# Altium project Bran.PrjPCB
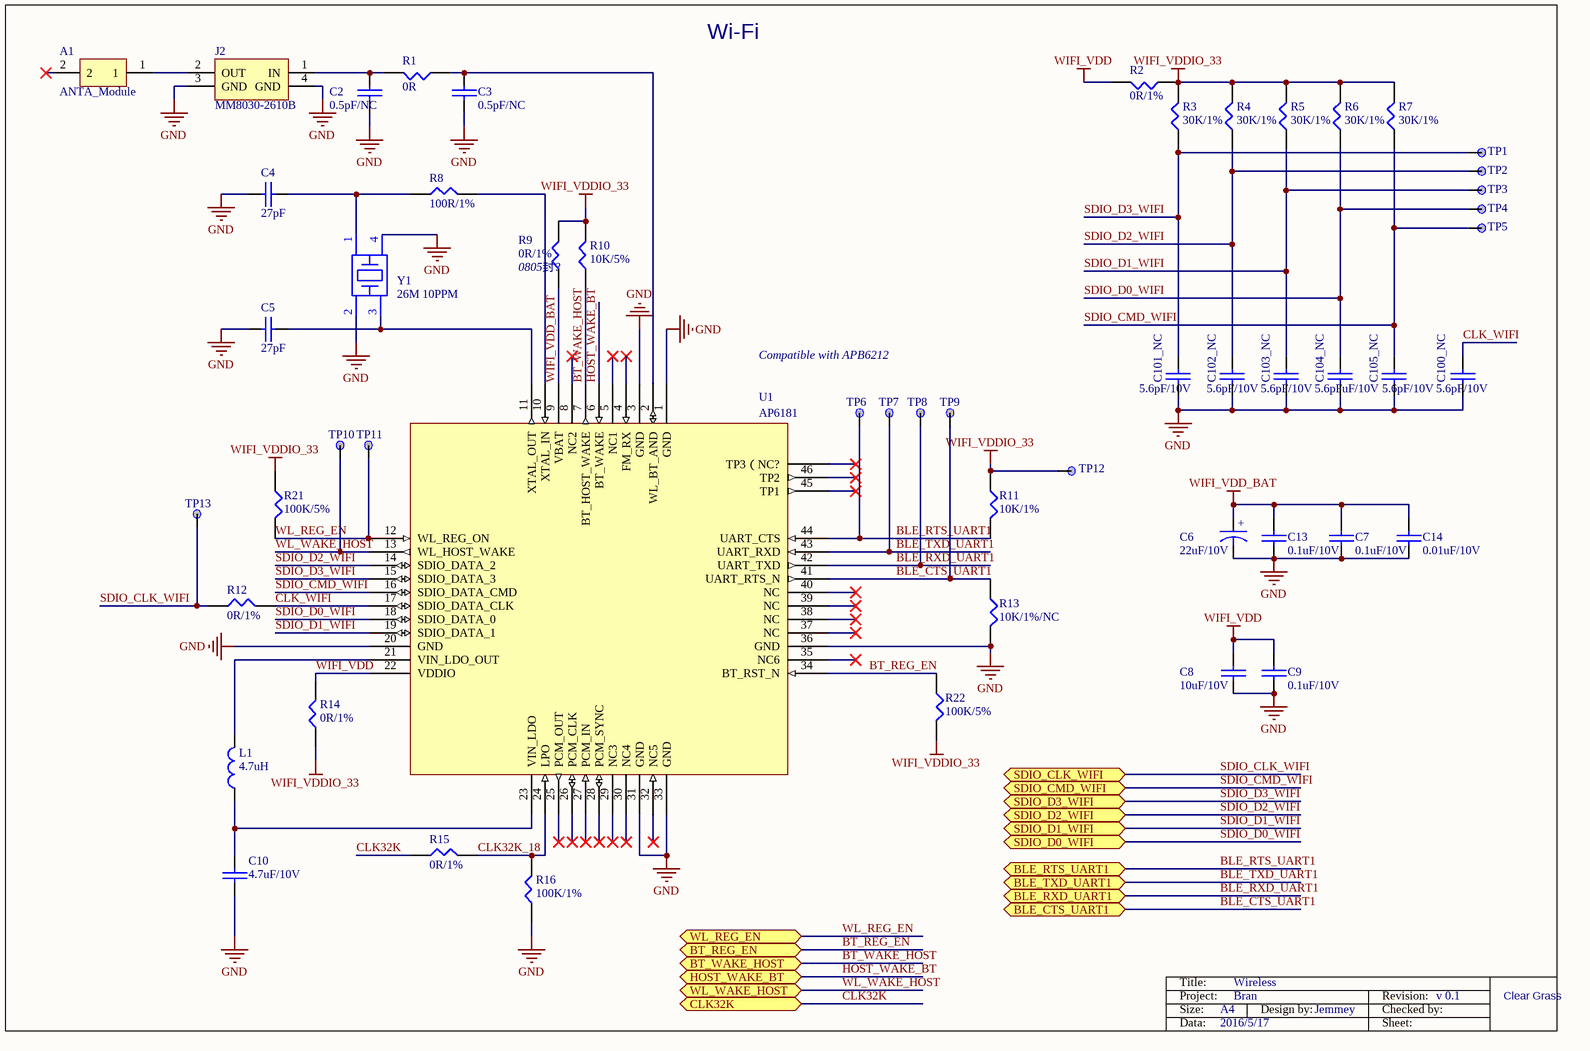
[diagram p0: Wireless.SchDoc]
8 sheets, 331 parts. Net scope: flat (ports and power ports of the same name join across sheets).
Sheets:
  Wireless.SchDoc
  NandFlash.SchDoc
  PMU.SchDoc
  Power.SchDoc
  Peripherals.SchDoc
  Auxiliary.SchDoc
  LCD_RGB.SchDoc
  M150.SchDoc

## Sheet Wireless.SchDoc: main_assy PCB
size A4

### Parts
A1  ANTA_Module  [IPEX]
C2  0.5pF/NC  [0402C]
C3  0.5pF/NC  [0402C]
C4  27pF  [0402C]
C5  27pF  [0402C]
C6  22uF/10V  [6032]
C7  0.1uF/10V  [0402C]
C8  10uF/10V  [0402C]
C9  0.1uF/10V  [0402C]
C10  4.7uF/10V  [0402C]
C13  0.1uF/10V  [0402C]
C14  0.01uF/10V  [0402C]
C100_NC  5.6pF/10V  [0402C]
C101_NC  5.6pF/10V  [0402C]
C102_NC  5.6pF/10V  [0402C]
C103_NC  5.6pF/10V  [0402C]
C104_NC  5.6pFuF/10V  [0402C]
C105_NC  5.6pF/10V  [0402C]
J2  MM8030-2610B  [IPEX]
L1  4.7uH  [Inductance]
R1  0R  [0402R]
R2  0R/1%  [0402R]
R3  30K/1%  [0402R]
R4  30K/1%  [0402R]
R5  30K/1%  [0402R]
R6  30K/1%  [0402R]
R7  30K/1%  [0402R]
R8  100R/1%  [0402R]
R9  0R/1%  [0402R]
R10  10K/5%  [0402R]
R11  10K/1%  [0402R]
R12  0R/1%  [0402R]
R13  10K/1%/NC  [0402R]
R14  0R/1%  [0402R]
R15  0R/1%  [0402R]
R16  100K/1%  [0402R]
R21  100K/5%  [0402R]
R22  100K/5%  [0402R]
TP1  TP  [TP_C40]  (value not drawn)
TP2  TP  [TP_C40]  (value not drawn)
TP3  TP  [TP_C40]  (value not drawn)
TP4  TP  [TP_C40]  (value not drawn)
TP5  TP  [TP_C40]  (value not drawn)
TP6  TP  [TP_C40]  (value not drawn)
TP7  TP  [TP_C40]  (value not drawn)
TP8  TP  [TP_C40]  (value not drawn)
TP9  TP  [TP_C40]  (value not drawn)
TP10  TP  [TP_C40]  (value not drawn)
TP11  TP  [TP_C40]  (value not drawn)
TP12  TP  [TP_C40]  (value not drawn)
TP13  TP  [TP_C40]  (value not drawn)
U1  AP6181
Y1  26M 10PPM  [XTALSMD2-2520]

### Ports
BLE_CTS_UART1 (bidir), BLE_RTS_UART1 (bidir), BLE_RXD_UART1 (bidir), BLE_TXD_UART1 (bidir), BT_REG_EN (bidir), BT_WAKE_HOST (bidir), CLK32K (bidir), HOST_WAKE_BT (bidir), SDIO_CLK_WIFI (bidir), SDIO_CMD_WIFI (bidir), SDIO_D0_WIFI (bidir), SDIO_D1_WIFI (bidir), SDIO_D2_WIFI (bidir), SDIO_D3_WIFI (bidir), WL_REG_EN (bidir), WL_WAKE_HOST (bidir)

### Nets
GND: C2.2 C3.2 C4.1 C5.1 C6.2 C7.1 C8.1 C9.1 C10.2 C13.1 C14.1 C100_NC.1 C101_NC.1 C102_NC.1 C103_NC.1 C104_NC.1 C105_NC.1 J2.3(GND) J2.4(GND) R13.2 R16.1 U1.1(GND) U1.3(GND) U1.20(GND) U1.31(GND) U1.33(GND) U1.36(GND) Y1.2 Y1.4
WIFI_VDD: C8.2 C9.2 R2.2 R14.2 U1.22(VDDIO)
WIFI_VDD_BAT: C6.1 C7.2 C13.2 C14.2 R9.1 U1.9(VBAT)
WIFI_VDDIO_33: R2.1 R3.2 R4.2 R5.2 R6.2 R7.2 R9.2 R10.2 R11.1 R14.1 R21.1 R22.2 TP12.1
BLE_CTS_UART1: R13.1 TP9.1 U1.41(UART_RTS_N) ; port BLE_CTS_UART1
BLE_RTS_UART1: R11.2 TP6.1 U1.44(UART_CTS) ; port BLE_RTS_UART1
BLE_RXD_UART1: TP8.1 U1.42(UART_TXD) ; port BLE_RXD_UART1
BLE_TXD_UART1: TP7.1 U1.43(UART_RXD) ; port BLE_TXD_UART1
BT_REG_EN: R22.1 U1.34(BT_RST_N) ; port BT_REG_EN
BT_WAKE_HOST: R10.1 U1.7(BT_HOST_WAKE) ; port BT_WAKE_HOST
CLK32K: R15.1 ; port CLK32K
CLK32K_18: R15.2 R16.2 U1.24(LPO)
CLK_WIFI: C100_NC.2 R12.2 U1.17(SDIO_DATA_CLK)
HOST_WAKE_BT: U1.6(BT_WAKE) ; port HOST_WAKE_BT
SDIO_CLK_WIFI: R12.1 TP13.1 ; port SDIO_CLK_WIFI
SDIO_CMD_WIFI: C105_NC.2 R7.1 TP5.1 U1.16(SDIO_DATA_CMD) ; port SDIO_CMD_WIFI
SDIO_D0_WIFI: C104_NC.2 R6.1 TP4.1 U1.18(SDIO_DATA_0) ; port SDIO_D0_WIFI
SDIO_D1_WIFI: C103_NC.2 R5.1 TP3.1 U1.19(SDIO_DATA_1) ; port SDIO_D1_WIFI
SDIO_D2_WIFI: C102_NC.2 R4.1 TP2.1 U1.14(SDIO_DATA_2) ; port SDIO_D2_WIFI
SDIO_D3_WIFI: C101_NC.2 R3.1 TP1.1 U1.15(SDIO_DATA_3) ; port SDIO_D3_WIFI
WL_REG_EN: R21.2 TP11.1 U1.12(WL_REG_ON) ; port WL_REG_EN
WL_WAKE_HOST: TP10.1 U1.13(WL_HOST_WAKE) ; port WL_WAKE_HOST
NetA1_1: A1.1 J2.2(OUT)
NetC2_1: C2.1 J2.1(IN) R1.2
NetC3_1: C3.1 R1.1 U1.2(WL_BT_AND)
NetC4_2: C4.2 R8.1 Y1.1
NetC5_2: C5.2 U1.11(XTAL_OUT) Y1.3
NetC10_1: C10.1 L1.1 U1.23(VIN_LDO)
NetL1_2: L1.2 U1.21(VIN_LDO_OUT)
NetR8_2: R8.2 U1.10(XTAL_IN)

Not connected (* = marked no-connect by the designer): A1 2*; U1 4(FM_RX)* 5(NC1)* 8(NC2)* 25(PCM_OUT)* 26(PCM_CLK)* 27(PCM_IN)* 28(PCM_SYNC)* 29(NC3)* 30(NC4)* 32(NC5)* 35(NC6)* 37(NC)* 38(NC)* 39(NC)* 40(NC)* 45(TP1)* 46(TP2)* ?1(TP3（NC?)*

### Notes on the sheet
- Wi-Fi
- (near R9) 0805封?
- Compatible with APB6212
- Title:
- Wireless
- Project:
- Size:
- Data:
- A4
- 2016/5/17
- Bran
- Design by:
- Jemmey
- Revision:
- Sheet:
- Checked by:
- v 0.1
- Clear Grass
- (in symbol Capacitor) +

### Library data of the parts
C2 = CAP: 厂家：Murata，型号：GRM1555C1H1R0BA01D
C3 = CAP: None
C4 C5 C7-C10 C13 C14 C100_NC C101_NC C102_NC C103_NC C104_NC C105_NC = CAP: 厂家：Murata，型号：GRM155R71A104KA01D
C6 = Capacitor
J2 = SMA: 厂家：Murata，型号：MM8030-2610B
L1 = CHOKE
R1 = RES1: 厂家：Yageo，型号：RC0402FR-070RL
R2-R16 R21 R22 = RES1: 厂家：Yageo，型号：RC0402FR-0710KL
TP1-TP13 = TP: Ordered by: Subcon
U1 = AP6181: 厂家：正基，型号：AP6181
Y1 = CRYSTAL2: 厂家：EPSON，型号：Q24FA20H0004400

## Sheet NandFlash.SchDoc: main_assy PCB
size A4
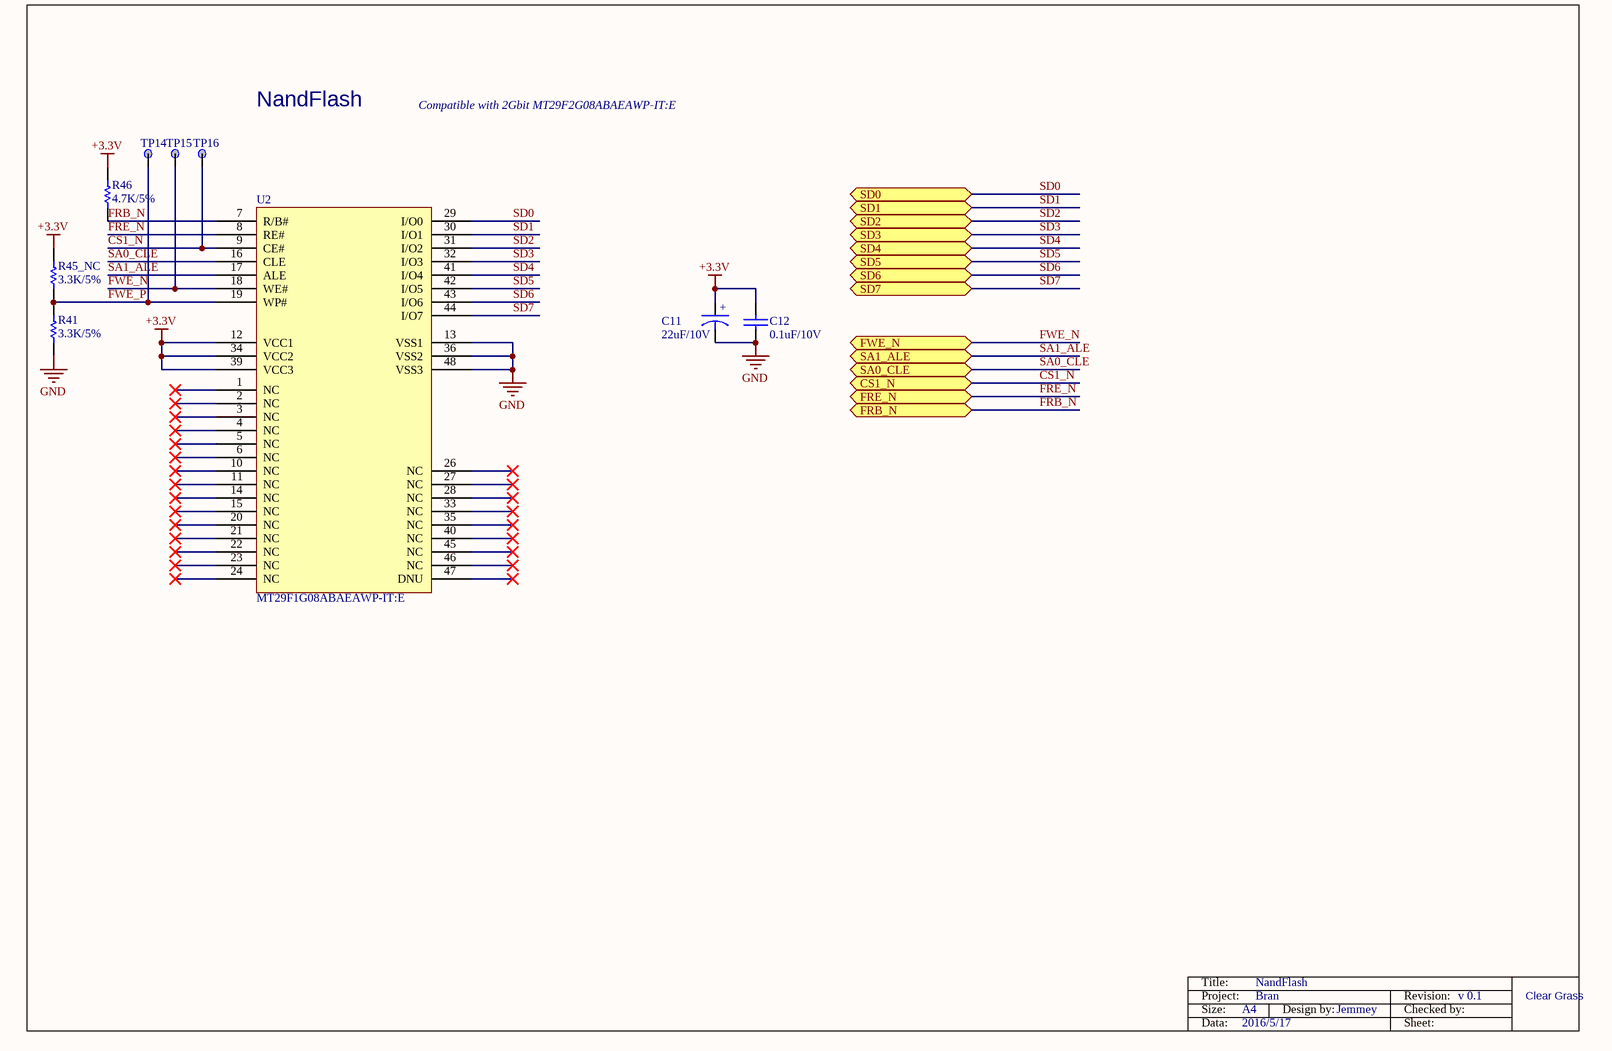
[diagram p1: NandFlash.SchDoc]

### Parts
C11  22uF/10V  [6032]
C12  0.1uF/10V  [0402C]
R41  3.3K/5%  [0603R]
R45_NC  3.3K/5%  [0603R]
R46  4.7K/5%  [0603R]
TP14  TP  [TP_C40]  (value not drawn)
TP15  TP  [TP_C40]  (value not drawn)
TP16  TP  [TP_C40]  (value not drawn)
U2  MT29F1G08ABAEAWP-IT:E

### Ports
CS1_N (bidir), FRB_N (bidir), FRE_N (bidir), FWE_N (bidir), SA0_CLE (bidir), SA1_ALE (bidir), SD0 (bidir), SD1 (bidir), SD2 (bidir), SD3 (bidir), SD4 (bidir), SD5 (bidir), SD6 (bidir), SD7 (bidir)

### Nets
+3.3V: C11.1 C12.2 R45_NC.1 R46.1 U2.12(VCC1) U2.34(VCC2) U2.39(VCC3)
GND: C11.2 C12.1 R41.2 U2.13(VSS1) U2.36(VSS2) U2.48(VSS3)
CS1_N: TP16.1 U2.9(CE#) ; port CS1_N
FRB_N: R46.2 U2.7(R/B#) ; port FRB_N
FRE_N: U2.8(RE#) ; port FRE_N
FWE_N: TP15.1 U2.18(WE#) ; port FWE_N
FWE_P: R41.1 R45_NC.2 TP14.1 U2.19(WP#)
SA0_CLE: U2.16(CLE) ; port SA0_CLE
SA1_ALE: U2.17(ALE) ; port SA1_ALE
SD0: U2.29(I/O0) ; port SD0
SD1: U2.30(I/O1) ; port SD1
SD2: U2.31(I/O2) ; port SD2
SD3: U2.32(I/O3) ; port SD3
SD4: U2.41(I/O4) ; port SD4
SD5: U2.42(I/O5) ; port SD5
SD6: U2.43(I/O6) ; port SD6
SD7: U2.44(I/O7) ; port SD7

Not connected (* = marked no-connect by the designer): U2 1(NC)* 2(NC)* 3(NC)* 4(NC)* 5(NC)* 6(NC)* 10(NC)* 11(NC)* 14(NC)* 15(NC)* 20(NC)* 21(NC)* 22(NC)* 23(NC)* 24(NC)* 26(NC)* 27(NC)* 28(NC)* 33(NC)* 35(NC)* 40(NC)* 45(NC)* 46(NC)* 47(DNU)*

### Notes on the sheet
- NandFlash
- Compatible with 2Gbit MT29F2G08ABAEAWP-IT:E
- Title:
- Project:
- Size:
- Data:
- A4
- 2016/5/17
- Bran
- Design by:
- Jemmey
- Revision:
- Sheet:
- Checked by:
- v 0.1
- Clear Grass
- (in symbol Capacitor) +

### Library data of the parts
C11 = Capacitor
C12 = CAP: 厂家：Murata，型号：GRM155R71A104KA01D
R41 R45_NC R46 = Res1: Resistor; Value: 1K; Ordered by: Subcon; Published: 8-Jun-2000; Revision: July-2002: Re-released for DXP Platform.; Publisher: Altium Limited
TP14-TP16 = TP: Ordered by: Subcon
U2 = NandFlash

## Sheet PMU.SchDoc: main_assy PCB
size A4
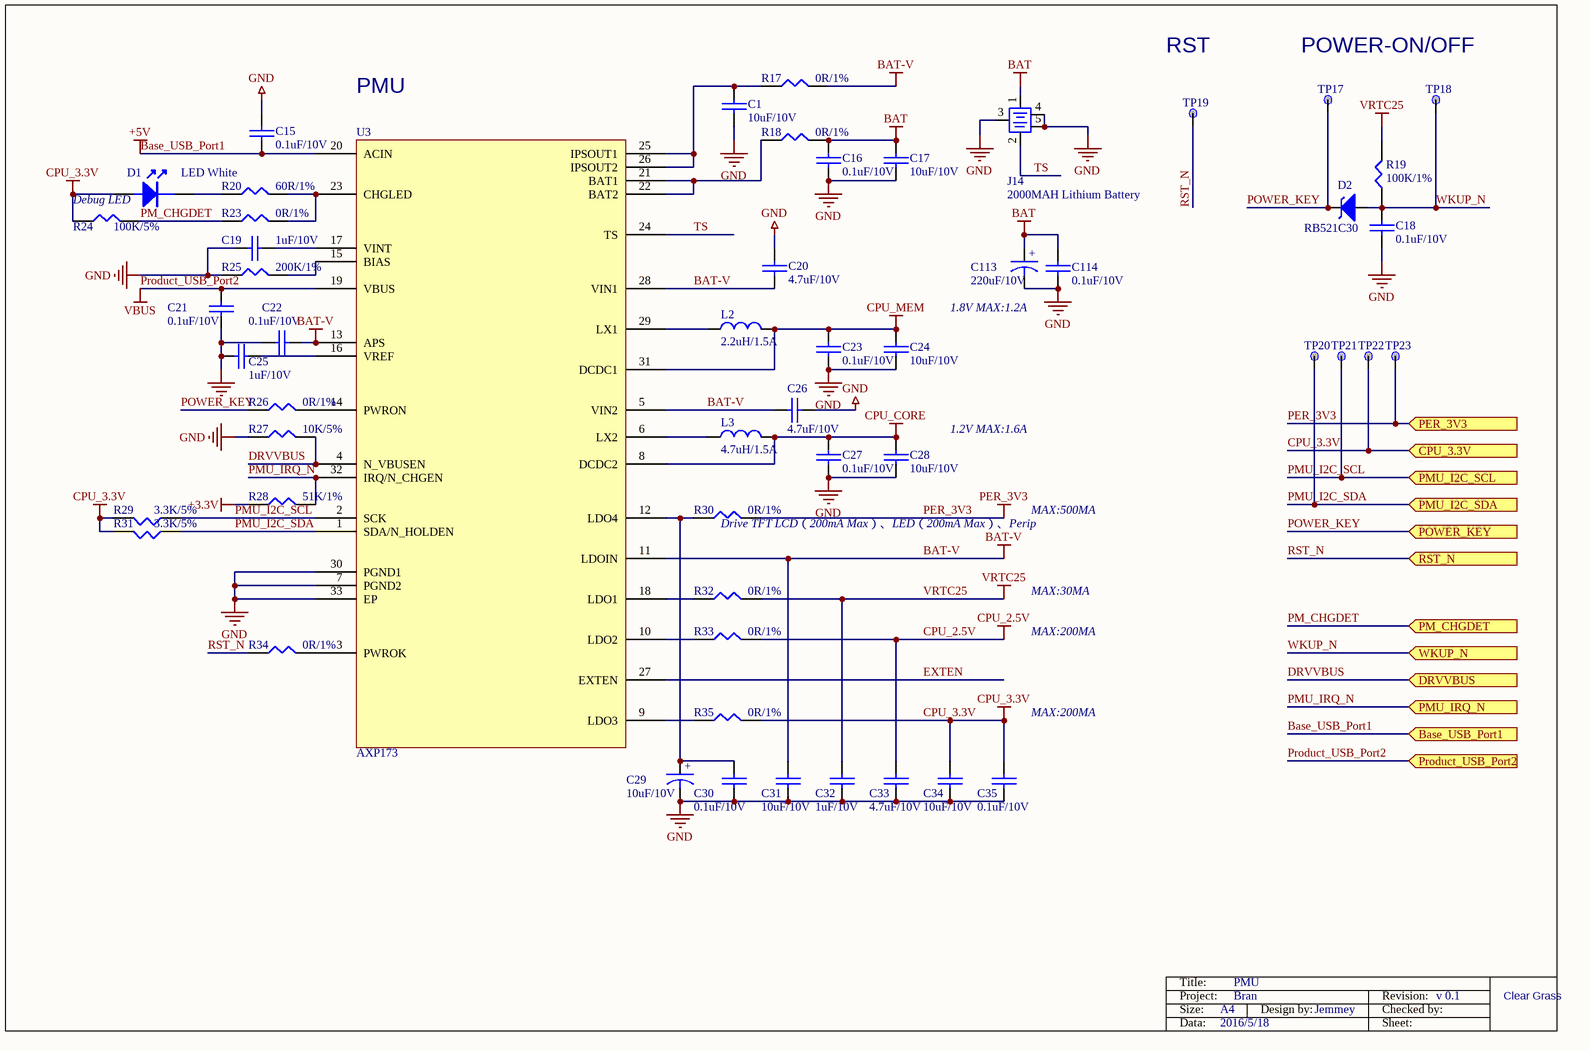
[diagram p2: PMU.SchDoc]

### Parts
C1  10uF/10V  [0402C]
C15  0.1uF/10V  [0402C]
C16  0.1uF/10V  [0402C]
C17  10uF/10V  [0402C]
C18  0.1uF/10V  [0402C]
C19  1uF/10V  [0402C]
C20  4.7uF/10V  [0402C]
C21  0.1uF/10V  [0402C]
C22  0.1uF/10V  [0402C]
C23  0.1uF/10V  [0402C]
C24  10uF/10V  [0402C]
C25  1uF/10V  [0402C]
C26  4.7uF/10V  [0402C]
C27  0.1uF/10V  [0402C]
C28  10uF/10V  [0402C]
C29  10uF/10V  [6032]
C30  0.1uF/10V  [0402C]
C31  10uF/10V  [0402C]
C32  1uF/10V  [0402C]
C33  4.7uF/10V  [0402C]
C34  10uF/10V  [0402C]
C35  0.1uF/10V  [0402C]
C113  220uF/10V  [6032]
C114  0.1uF/10V  [0402C]
D1  LED White  [0402LED]
D2  RB521C30  [DO-214AC]
J14  2000MAH Lithium Battery  [Molex-1-3A]
L2  2.2uH/1.5A  [Inductance]
L3  4.7uH/1.5A  [Inductance]
R17  0R/1%  [0402R]
R18  0R/1%  [0402R]
R19  100K/1%  [0402R]
R20  60R/1%  [0402R]
R23  0R/1%  [0402R]
R24  100K/5%  [0402R]
R25  200K/1%  [0402R]
R26  0R/1%  [0402R]
R27  10K/5%  [0402R]
R28  51K/1%  [0402R]
R29  3.3K/5%  [0402R]
R30  0R/1%  [0402R]
R31  3.3K/5%  [0402R]
R32  0R/1%  [0402R]
R33  0R/1%  [0402R]
R34  0R/1%  [0402R]
R35  0R/1%  [0402R]
TP17  TP  [TP_C40]  (value not drawn)
TP18  TP  [TP_C40]  (value not drawn)
TP19  TP  [TP_C40]  (value not drawn)
TP20  TP  [TP_C40]  (value not drawn)
TP21  TP  [TP_C40]  (value not drawn)
TP22  TP  [TP_C40]  (value not drawn)
TP23  TP  [TP_C40]  (value not drawn)
U3  AXP173

### Ports
Base_USB_Port1 (in), CPU_3.3V (in), DRVVBUS (in), PER_3V3 (in), PM_CHGDET (in), PMU_I2C_SCL (in), PMU_I2C_SDA (in), PMU_IRQ_N (in), POWER_KEY (in), Product_USB_Port2 (in), RST_N (in), WKUP_N (in)

### Nets
+3.3V: R28.1
Base_USB_Port1: C15.1 U3.20(ACIN) ; port Base_USB_Port1  [also labelled +5V]
BAT: C16.2 C17.2 C113.1 C114.2 J14.1(VCC) R18.2
BAT-V: C20.2 C22.1 C26.2 C31.1 R17.2 U3.5(VIN2) U3.11(LDOIN) U3.13(APS) U3.28(VIN1)
CPU_2.5V: C33.1 R33.2
CPU_3.3V: C34.1 C35.1 D1.2 R24.1 R29.2 R31.2 R35.2 TP22.1 ; port CPU_3.3V
CPU_CORE: C27.2 C28.2 L3.2 U3.8(DCDC2)
CPU_MEM: C23.2 C24.2 L2.2 U3.31(DCDC1)
GND: C1.1 C15.2 C16.1 C17.1 C18.1 C19.2 C20.1 C21.1 C22.2 C23.1 C24.1 C25.2 C26.1 C27.1 C28.1 C29.2 C30.1 C31.2 C32.2 C33.2 C34.2 C35.2 C113.2 C114.1 J14.3(GND) J14.4(PAD) J14.5(PAD) R25.1 R27.1 U3.7(PGND2) U3.30(PGND1) U3.33(EP)
PER_3V3: R30.2 TP23.1 ; port PER_3V3
Product_USB_Port2: C21.2 U3.19(VBUS) ; port Product_USB_Port2  [also labelled VBUS]
VRTC25: C32.1 R19.2 R32.2
DRVVBUS: R27.2 U3.4(N_VBUSEN) ; port DRVVBUS
EXTEN: U3.27(EXTEN)
PM_CHGDET: R23.1 R24.2 ; port PM_CHGDET
PMU_I2C_SCL: R29.1 TP21.1 U3.2(SCK) ; port PMU_I2C_SCL
PMU_I2C_SDA: R31.1 TP20.1 U3.1(SDA/N_HOLDEN) ; port PMU_I2C_SDA
PMU_IRQ_N: R28.2 U3.32(IRQ/N_CHGEN) ; port PMU_IRQ_N
POWER_KEY: D2.1(K) R26.1 TP17.1 ; port POWER_KEY
RST_N: R34.1 TP19.1 ; port RST_N
TS: J14.2(NTC) U3.24(TS)
WKUP_N: C18.2 D2.2(A) R19.1 TP18.1 ; port WKUP_N
NetC1_2: C1.2 R17.1 U3.25(IPSOUT1) U3.26(IPSOUT2)
NetC19_1: C19.1 U3.17(VINT)
NetC25_1: C25.1 U3.16(VREF)
NetC29_1: C29.1 C30.2 R30.1 U3.12(LDO4)
NetD1_1: D1.1 R20.1
NetL2_1: L2.1 U3.29(LX1)
NetL3_1: L3.1 U3.6(LX2)
NetR18_1: R18.1 U3.21(BAT1) U3.22(BAT2)
NetR20_2: R20.2 R23.2 U3.23(CHGLED)
NetR25_2: R25.2 U3.15(BIAS)
NetR26_2: R26.2 U3.14(PWRON)
NetR32_1: R32.1 U3.18(LDO1)
NetR33_1: R33.1 U3.10(LDO2)
NetR34_2: R34.2 U3.3(PWROK)
NetR35_1: R35.1 U3.9(LDO3)

### Notes on the sheet
- PMU
- RST
- POWER-ON/OFF
- (near D1) Debug LED
- 1.8V MAX:1.2A
- 1.2V MAX:1.6A
- MAX:500MA
- (near R30) Drive TFT LCD（200mA Max）、LED（200mA Max）、Perip
- MAX:30MA
- MAX:200MA
- Title:
- Project:
- Size:
- Data:
- A4
- 2016/5/18
- Bran
- Design by:
- Jemmey
- Revision:
- Sheet:
- Checked by:
- v 0.1
- Clear Grass
- (in symbol Capacitor) +

### Library data of the parts
C1 C15-C28 C30-C35 C114 = CAP: 厂家：Murata，型号：GRM155R71A104KA01D
C29 C113 = Capacitor
D1 = LED: 厂家：ROHM，型号：SCMP13WBC8W1**
D2 = Sc: 厂家：ROHM，型号：RB480Y-90
J14 = BL-5C
L2 L3 = CHOKE
R17-R20 R23-R35 = RES1: 厂家：Yageo，型号：RC0402FR-0710KL
TP17-TP23 = TP: Ordered by: Subcon

## Sheet Power.SchDoc: main_assy PCB
size A4
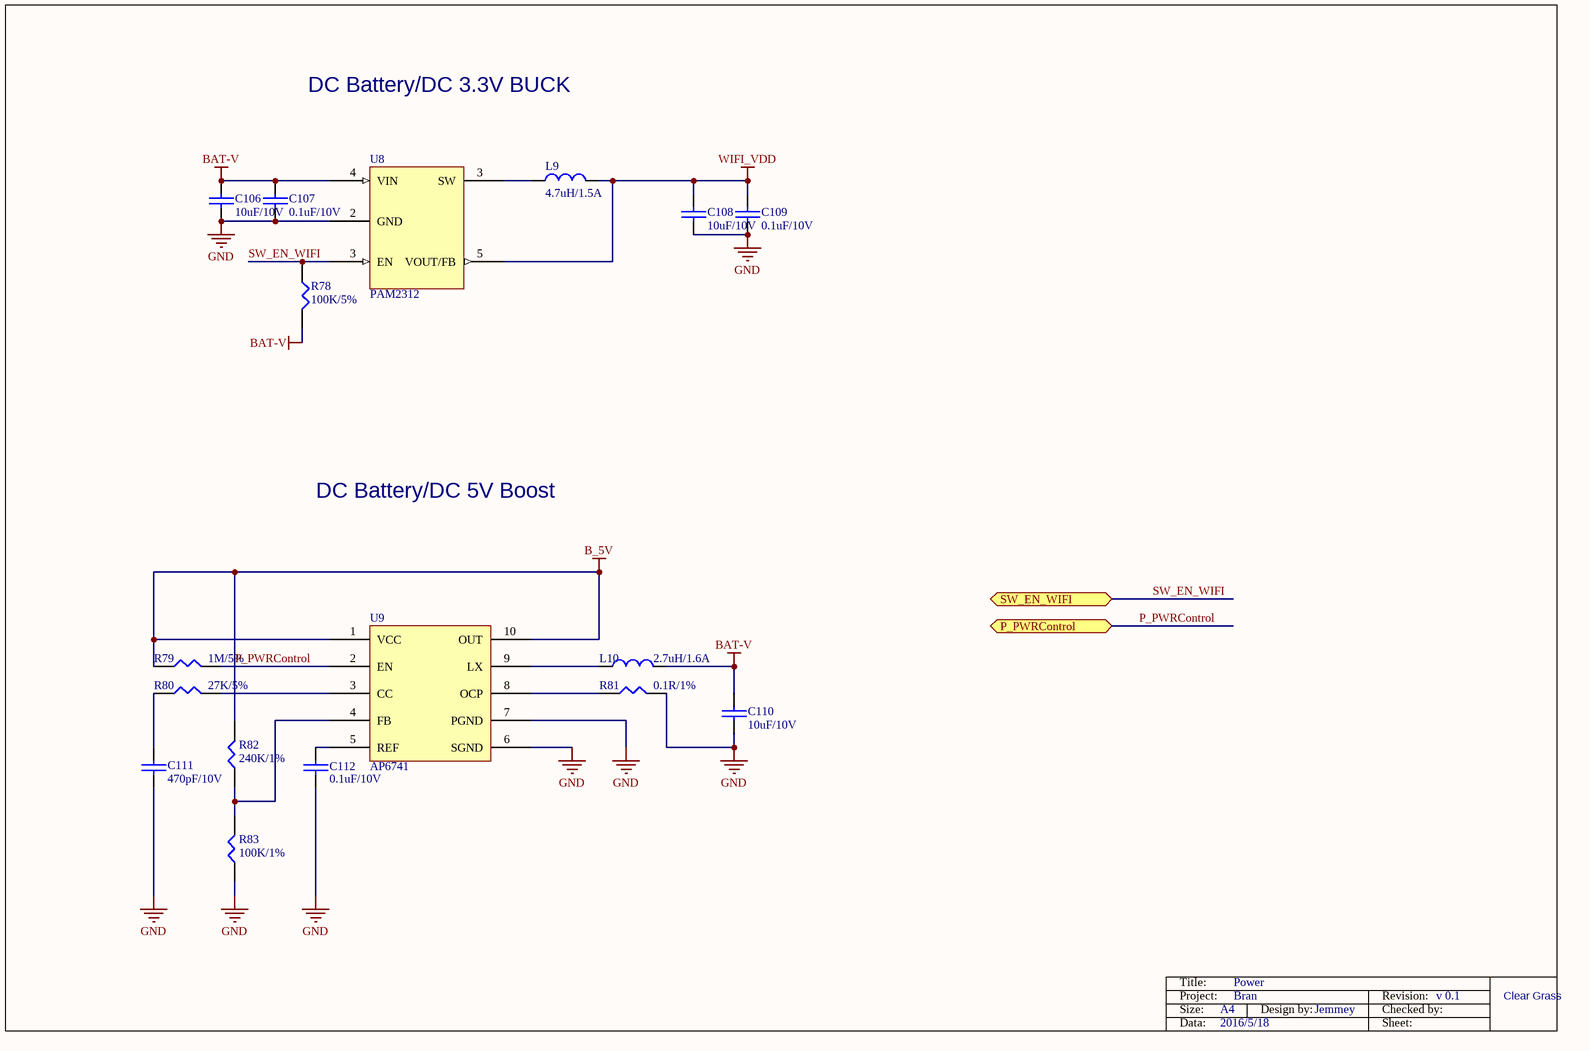
[diagram p3: Power.SchDoc]

### Parts
C106  10uF/10V  [0402C]
C107  0.1uF/10V  [0402C]
C108  10uF/10V  [0402C]
C109  0.1uF/10V  [0402C]
C110  10uF/10V  [0402C]
C111  470pF/10V  [0402C]
C112  0.1uF/10V  [0402C]
L9  4.7uH/1.5A  [Inductance]
L10  2.7uH/1.6A  [Inductance]
R78  100K/5%  [0402R]
R79  1M/5%  [0402R]
R80  27K/5%  [0402R]
R81  0.1R/1%  [1206]
R82  240K/1%  [0402R]
R83  100K/1%  [0402R]
U8  PAM2312  [MOLEX_47590001]
U9  AP6741  [MOLEX_47590001]

### Ports
P_PWRControl (bidir), SW_EN_WIFI (bidir)

### Nets
BAT-V: C106.2 C107.2 C110.2 L10.2 R78.2 U8.4(VIN)
GND: C106.1 C107.1 C108.1 C109.1 C110.1 C111.1 C112.1 R81.2 R83.1 U8.2(GND) U9.6(SGND) U9.7(PGND)
P_PWRControl: R79.1 R79.2 R82.2 U9.1(VCC) U9.2(EN) U9.10(OUT) ; port P_PWRControl  [also labelled B_5V]
WIFI_VDD: C108.2 C109.2 L9.2 U8.5(VOUT/FB)
SW_EN_WIFI: R78.1 U8.3(EN) ; port SW_EN_WIFI
NetC111_2: C111.2 R80.1
NetC112_2: C112.2 U9.5(REF)
NetL9_1: L9.1 U8.3(SW)
NetL10_1: L10.1 U9.9(LX)
NetR80_2: R80.2 U9.3(CC)
NetR81_1: R81.1 U9.8(OCP)
NetR82_1: R82.1 R83.2 U9.4(FB)

### Notes on the sheet
- DC Battery/DC 3.3V BUCK
- DC Battery/DC 5V Boost
- Title:
- Power
- Project:
- Size:
- Data:
- A4
- 2016/5/18
- Bran
- Design by:
- Jemmey
- Revision:
- Sheet:
- Checked by:
- v 0.1
- Clear Grass

### Library data of the parts
C106-C112 = CAP: 厂家：Murata，型号：GRM155R71A104KA01D
L9 L10 = CHOKE
R78-R83 = RES1: 厂家：Yageo，型号：RC0402FR-0710KL
U8 = P: 厂家：Diodes，型号：PAM2312TSOT255330; Manuf_1: MOLEX; Manuf_Part_1: 475900001; Ordered by: Subcon; Silkscreen: USB USER
U9 = PAM: 厂家：Diodes，型号：PAM2401YPADJ; Manuf_1: MOLEX; Manuf_Part_1: 475900001; Ordered by: Subcon; Silkscreen: USB USER

## Sheet Peripherals.SchDoc: main_assy PCB
size A4
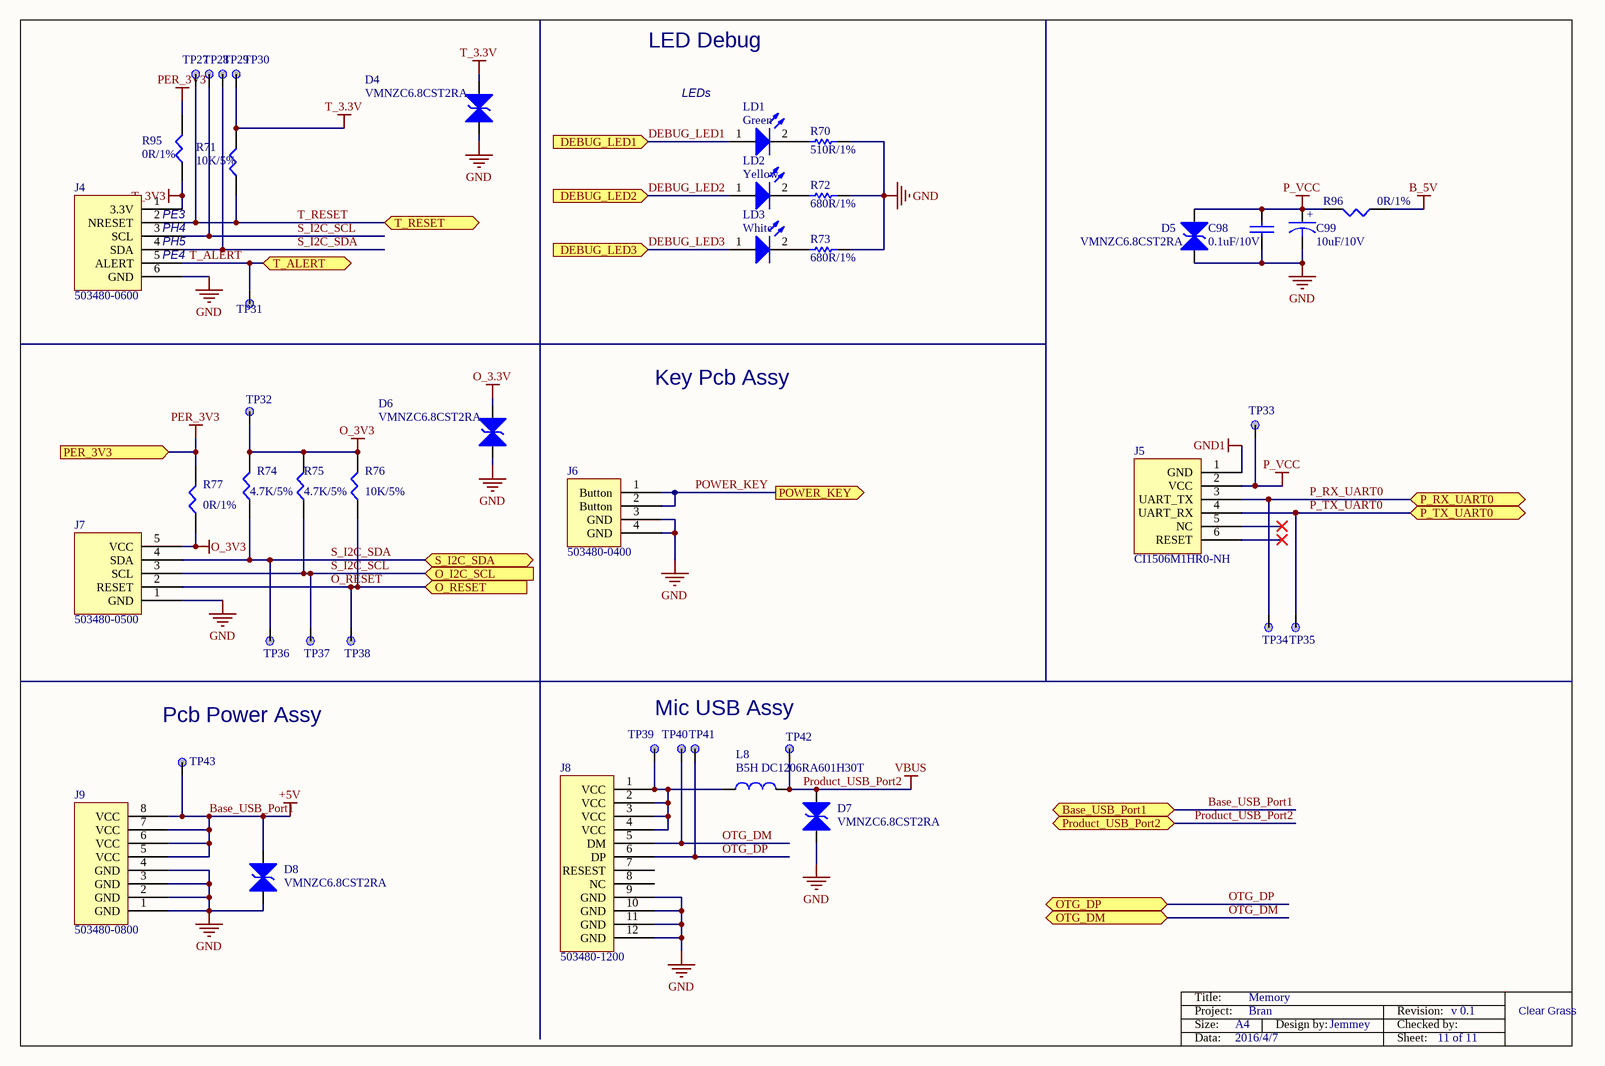
[diagram p4: Peripherals.SchDoc]

### Parts
(Parts that share a designator on the sheet are numbered #1, #2 ... from top to bottom, then left to right.)
C98  0.1uF/10V  [0402C]
C99  10uF/10V  [6032]
D4  VMNZC6.8CST2RA  [0402]
D5  VMNZC6.8CST2RA  [0402]
D6  VMNZC6.8CST2RA  [0402]
D7  VMNZC6.8CST2RA  [0402]
D8  VMNZC6.8CST2RA  [0402]
J4  503480-0600
J5  CI1506M1HR0-NH
J6#1  503480-0400
J7  503480-0500
J8  503480-1200
J9  503480-0800
L8  B5H DC1206RA601H30T  [1206]
LD1  Green  [0603D]
LD2  Yellow  [0603D]
LD3  White  [0603D]
R70  510R/1%  [0402R]
R71  10K/5%  [0402R]
R72  680R/1%  [0402R]
R73  680R/1%  [0402R]
R74  4.7K/5%  [0402R]
R75  4.7K/5%  [0402R]
R76  10K/5%  [0402R]
R77  0R/1%  [0402R]
R95  0R/1%  [0603R]
R96  0R/1%  [0603R]
TP27  TP  [TP_C40]  (value not drawn)
TP28  TP  [TP_C40]  (value not drawn)
TP29  TP  [TP_C40]  (value not drawn)
TP30  TP  [TP_C40]  (value not drawn)
TP31  TP  [TP_C40]  (value not drawn)
TP32  TP  [TP_C40]  (value not drawn)
TP33  TP  [TP_C40]  (value not drawn)
TP34  TP  [TP_C40]  (value not drawn)
TP35  TP  [TP_C40]  (value not drawn)
TP36  TP  [TP_C40]  (value not drawn)
TP37  TP  [TP_C40]  (value not drawn)
TP38  TP  [TP_C40]  (value not drawn)
TP39  TP  [TP_C40]  (value not drawn)
TP40  TP  [TP_C40]  (value not drawn)
TP41  TP  [TP_C40]  (value not drawn)
TP42  TP  [TP_C40]  (value not drawn)
TP43  TP  [TP_C40]  (value not drawn)

### Ports
Base_USB_Port1 (bidir), DEBUG_LED1 (in), DEBUG_LED2 (in), DEBUG_LED3 (in), O_I2C_SCL (in), O_RESET (in), OTG_DM (bidir), OTG_DP (bidir), P_RX_UART0 (bidir), P_TX_UART0 (bidir), PER_3V3 (in), POWER_KEY (out), Product_USB_Port2 (bidir), S_I2C_SDA (bidir), T_ALERT (bidir), T_RESET (bidir)

### Nets
B_5V: R96.1  [project net P_PWRControl]
Base_USB_Port1: D8.2(dIode2) J9.5(VCC) J9.6(VCC) J9.7(VCC) J9.8(VCC) TP43.1 ; port Base_USB_Port1  [also labelled +5V]
GND: C98.1 C99.2 D4.1(Diode1) D5.1(Diode1) D6.1(Diode1) D7.1(Diode1) D8.1(Diode1) J4.6(GND) J6#1.3(GND) J6#1.4(GND) J7.1(GND) J8.9(GND) J8.10(GND) J8.11(GND) J8.12(GND) J9.1(GND) J9.2(GND) J9.3(GND) J9.4(GND) R70.1 R72.1 R73.1
GND1: J5.1(GND)
O_3.3V: D6.2(dIode2)
O_3V3: J7.5(VCC) R74.2 R75.2 R76.2 R77.1 TP32.1
P_VCC: C98.2 C99.1 D5.2(dIode2) J5.2(VCC) R96.2 TP33.1
PER_3V3: R77.2 R95.2 ; port PER_3V3
Product_USB_Port2: D7.2(dIode2) L8.2 TP42.1 ; port Product_USB_Port2  [also labelled VBUS]
T_3.3V: D4.2(dIode2) R71.2 TP30.1
T_3V3: J4.1(3.3V) R95.1
DEBUG_LED1: LD1.1(A) ; port DEBUG_LED1
DEBUG_LED2: LD2.1(A) ; port DEBUG_LED2
DEBUG_LED3: LD3.1(A) ; port DEBUG_LED3
O_RESET: J7.2(RESET) R76.1 TP38.1 ; port O_RESET
OTG_DM: J8.5(DM) TP40.1 ; port OTG_DM
OTG_DP: J8.6(DP) TP41.1 ; port OTG_DP
P_RX_UART0: J5.3(UART_TX) TP34.1 ; port P_RX_UART0
P_TX_UART0: J5.4(UART_RX) TP35.1 ; port P_TX_UART0
POWER_KEY: J6#1.1(Button) J6#1.2(Button) ; port POWER_KEY
S_I2C_SCL: J4.3(SCL) J7.3(SCL) R75.1 TP28.1 TP37.1 ; port O_I2C_SCL
S_I2C_SDA: J4.4(SDA) J7.4(SDA) R74.1 TP29.1 TP36.1 ; port S_I2C_SDA
T_ALERT: J4.5(ALERT) TP31.1 ; port T_ALERT
T_RESET: J4.2(NRESET) R71.1 TP27.1 ; port T_RESET
NetJ8_1: J8.1(VCC) J8.2(VCC) J8.3(VCC) J8.4(VCC) L8.1 TP39.1
NetLD1_2: LD1.2(K) R70.2
NetLD2_2: LD2.2(K) R72.2
NetLD3_2: LD3.2(K) R73.2

Not connected (* = marked no-connect by the designer): J5 5(NC)* 6(RESET)*; J8 7(RESEST) 8(NC)

### Notes on the sheet
- LED Debug
- LEDs
- (near J4) PE4
- (near J4) PE3
- (near J4) PH4
- (near J4) PH5
- Key Pcb Assy
- (near TP43) Pcb Power Assy
- Mic USB Assy
- Title:
- Memory
- Project:
- Size:
- Data:
- A4
- 2016/4/7
- Bran
- Design by:
- Jemmey
- Revision:
- Sheet:
- Checked by:
- 11 of 11
- v 0.1
- Clear Grass
- (in symbol Capacitor) +

### Library data of the parts
C98 = CAP: 厂家：Murata，型号：GRM155R71A104KA01D
C99 = Capacitor
D4-D8 = ESD_1: 厂家：ROHM，型号：VMNZC6.8CST2RA
J4 = 50348: 厂家：Molex，型号：503480-0600
J5 = CI1506M1HR0-NH: 厂家：瀚荃股份，型号：CI1506M1HR0-NH
J6#1 = 50348: 厂家：Molex，型号：503480-0400
J7 = 50348: 厂家：Molex，型号：503480-0500
J8 = 50348: 厂家：Molex，型号：503480-1200
J9 = 50348: 厂家：Molex，型号：503480-0800
L8 = CHOKE: 厂家：宇磁，型号：B5H DC1206RA601H30T
LD1-LD3 = LED2: Typical RED, GREEN, YELLOW, AMBER GaAs LED; Ordered by: Subcon; ECCN_US/EU: EAR99/NEC; Published: 8-Jun-2000; Revision: July-2002: Re-released for DXP Platform.; Publisher: Altium Limited
R70 R72 R73 = Res1: Resistor; Value: 1K; Ordered by: Subcon; Published: 8-Jun-2000; Revision: July-2002: Re-released for DXP Platform.; Publisher: Altium Limited
R71 R74 R75 R77 = RES1: 厂家：Yageo，型号：
R76 = RES1: 厂家：Yageo，型号：RC0402FR-0710KL
R95 R96 = RES1: 厂家：Yageo，型号：RC0402FR-070RL
TP27-TP43 = TP: Ordered by: Subcon

## Sheet Auxiliary.SchDoc: main_assy PCB
size A4
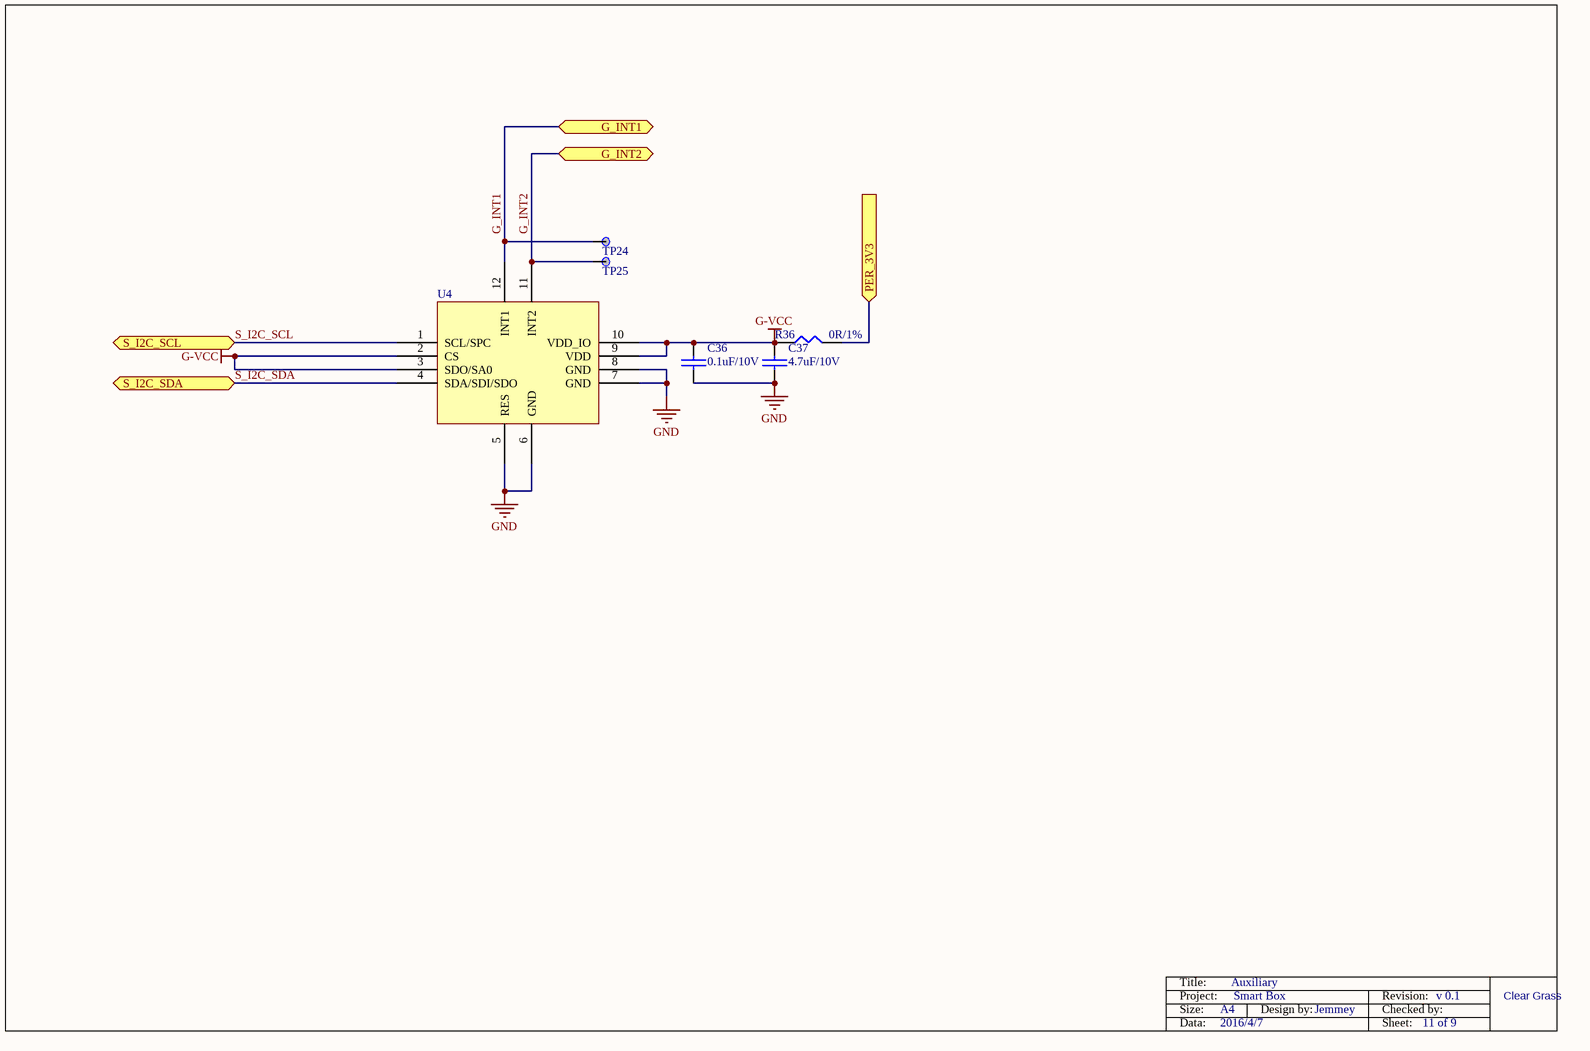
[diagram p5: Auxiliary.SchDoc]

### Parts
C36  0.1uF/10V  [0402C]
C37  4.7uF/10V  [0603C]
R36  0R/1%  [0402R]
TP24  TP  [TP_C40]  (value not drawn)
TP25  TP  [TP_C40]  (value not drawn)
U4  (no value)

### Ports
G_INT1 (bidir), G_INT2 (bidir), PER_3V3 (in), S_I2C_SCL (bidir), S_I2C_SDA (bidir)

### Nets
G-VCC: C36.1 C37.1 R36.1 U4.2(CS) U4.3(SDO/SA0) U4.9(VDD) U4.10(VDD_IO)
GND: C36.2 C37.2 U4.5(RES) U4.6(GND) U4.7(GND) U4.8(GND)
PER_3V3: R36.2 ; port PER_3V3
G_INT1: TP24.1 U4.12(INT1) ; port G_INT1
G_INT2: TP25.1 U4.11(INT2) ; port G_INT2
S_I2C_SCL: U4.1(SCL/SPC) ; port S_I2C_SCL
S_I2C_SDA: U4.4(SDA/SDI/SDO) ; port S_I2C_SDA

### Notes on the sheet
- Title:
- Auxiliary
- Project:
- Size:
- Data:
- A4
- 2016/4/7
- Smart Box
- Design by:
- Jemmey
- Revision:
- Sheet:
- Checked by:
- 11 of 9
- v 0.1
- Clear Grass

### Library data of the parts
C36 = CAP: 厂家：Murata，型号：GRM155R71A104KA01D
C37 = CAP: 厂家：Murata，型号：GRM188R61A106KE69D
R36 = RES1: 厂家：Yageo，型号：RC0402FR-0710KL
TP24 TP25 = TP: Ordered by: Subcon
U4 = LIS2DE12: 厂家：ST，型号：LIS2DH12

## Sheet LCD_RGB.SchDoc
size A3
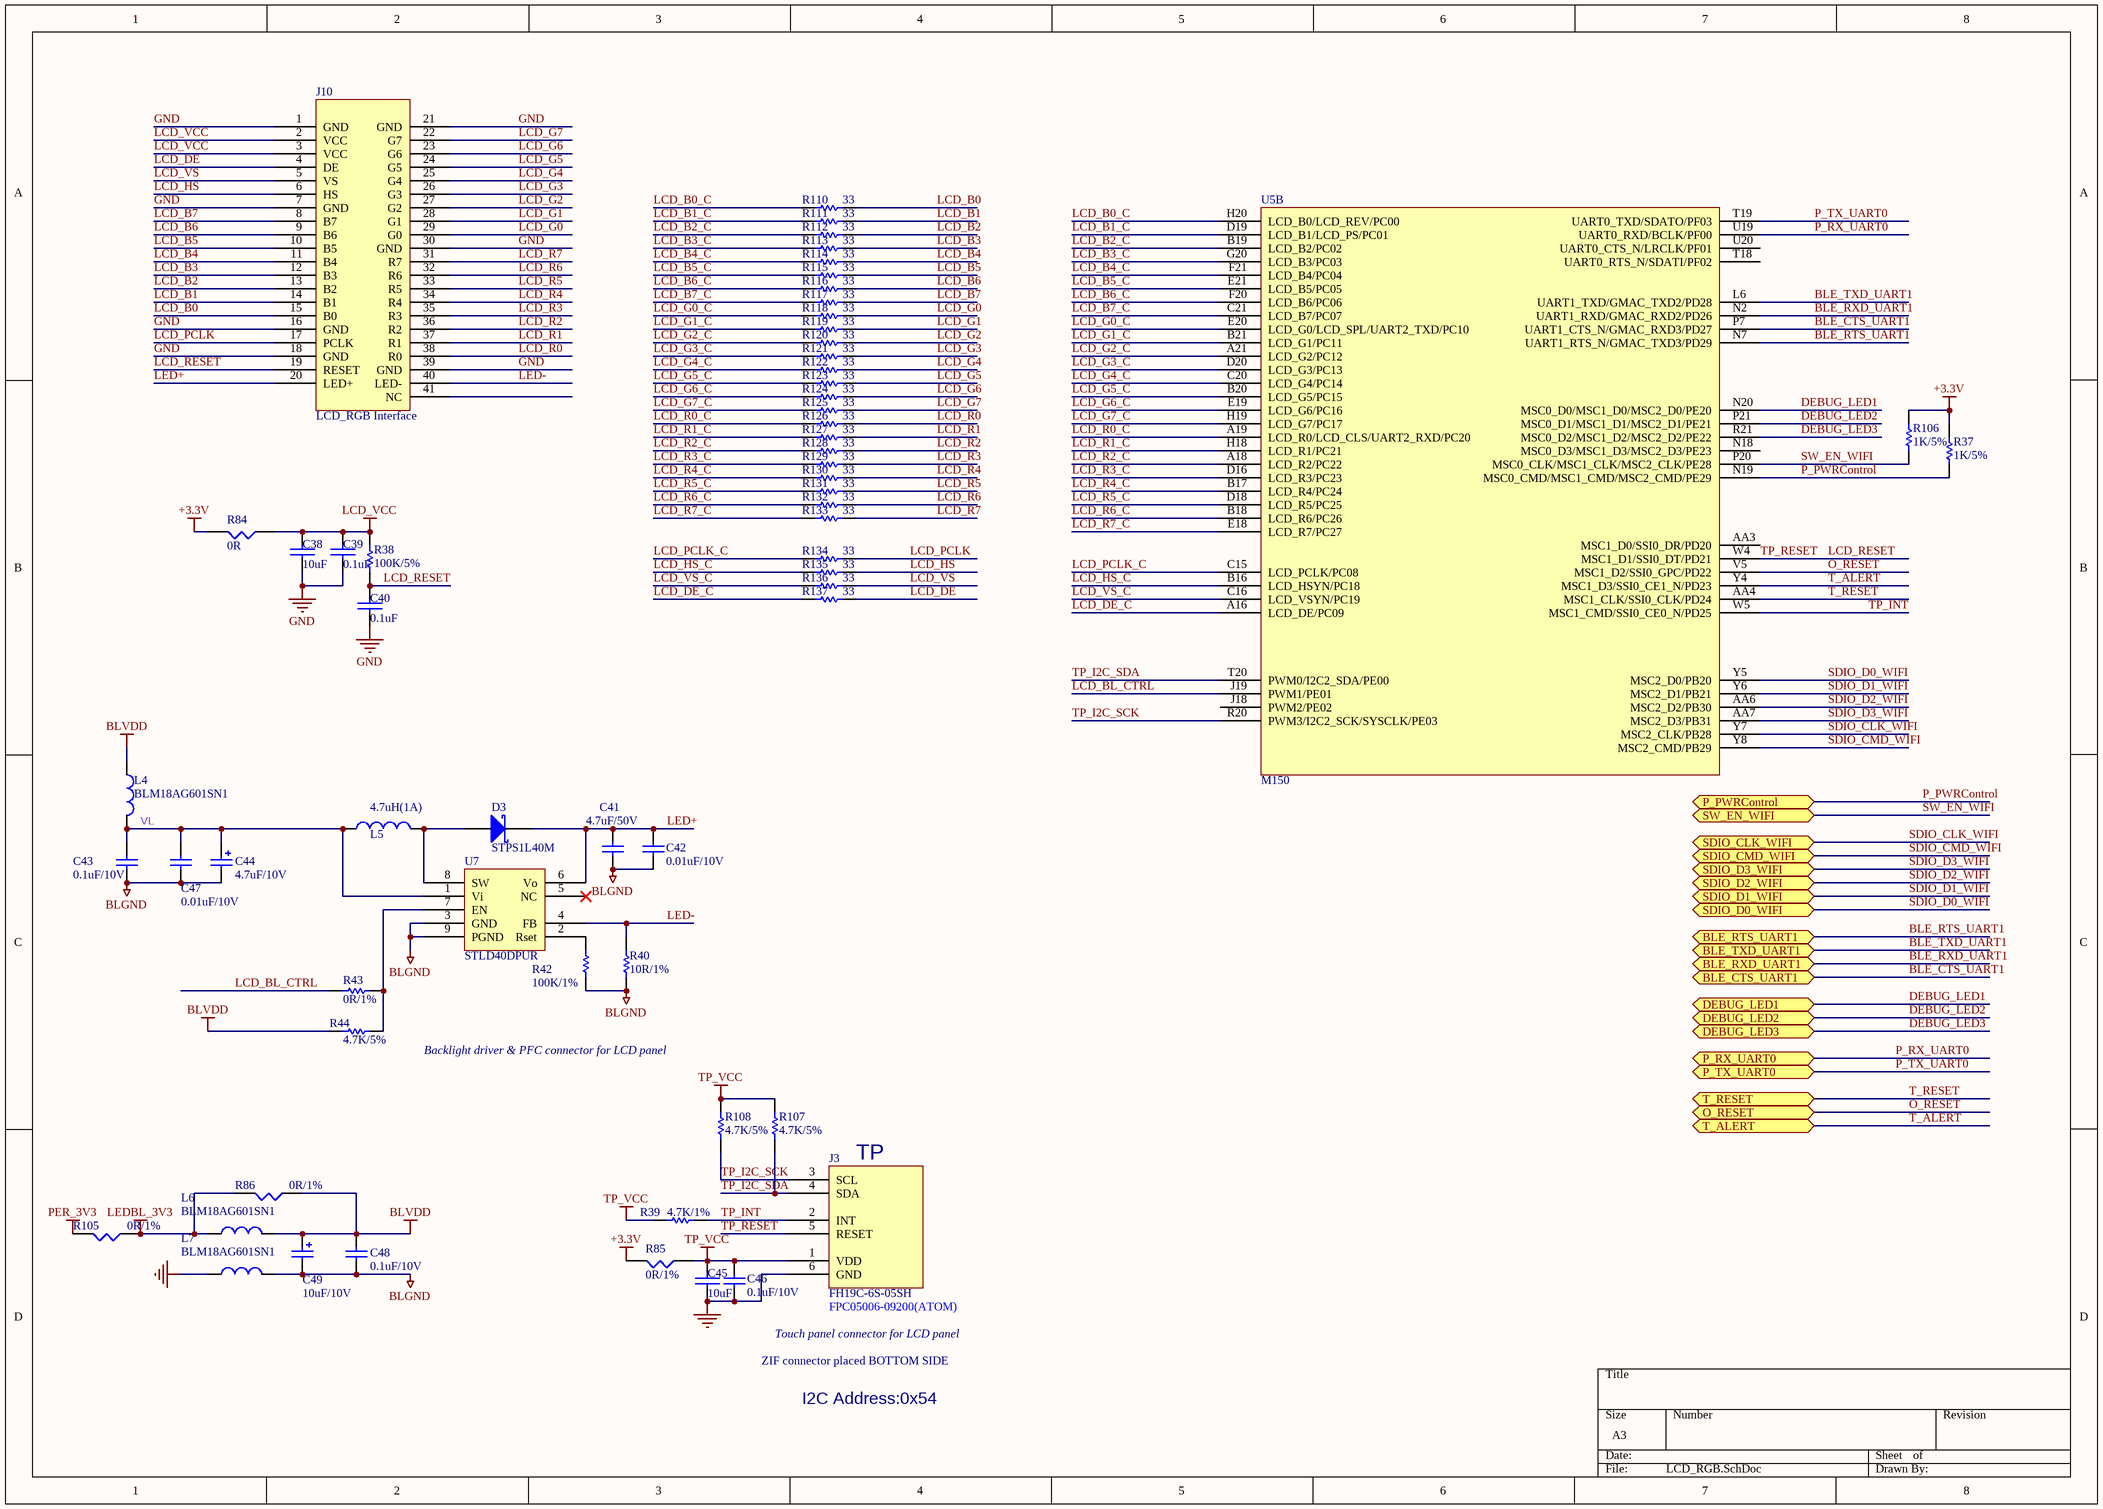
[diagram p6: LCD_RGB.SchDoc]

### Parts
C38  10uF  [0402C]
C39  0.1uF  [0402C]
C40  0.1uF  [0402C]
C41  4.7uF/50V  [0603C]
C42  0.01uF/10V  [0402C]
C43  0.1uF/10V  [0402C]
C44  4.7uF/10V  [1206]
C45  10uF  [0402C]
C46  0.1uF/10V  [0402C]
C47  0.01uF/10V  [0402C]
C48  0.1uF/10V  [0402C]
C49  10uF/10V  [TAN-A]
D3  STPS1L40M  [DO-216AA]
J3  FH19C-6S-05SH  [FH19C-6S-0R5SH_FPC_CPT]
J10  LCD_RGB Interface
L4  BLM18AG601SN1  [0603R]
L5  4.7uH(1A)  [1210L]
L6  BLM18AG601SN1  [0603R]
L7  BLM18AG601SN1  [0603R]
R37  1K/5%  [0402R]
R38  100K/5%  [0402R]
R39  4.7K/1%  [0402R]
R40  10R/1%  [0402R]
R42  100K/1%  [0402R]
R43  0R/1%  [0603R]
R44  4.7K/5%  [0402R]
R84  0R  [0603R]
R85  0R/1%  [0603R]
R86  0R/1%  [0603R]
R105  0R/1%  [0603R]
R106  1K/5%  [0402R]
R107  4.7K/5%  [0402R]
R108  4.7K/5%  [0402R]
R110  33  [0402R]
R111  33  [0402R]
R112  33  [0402R]
R113  33  [0402R]
R114  33  [0402R]
R115  33  [0402R]
R116  33  [0402R]
R117  33  [0402R]
R118  33  [0402R]
R119  33  [0402R]
R120  33  [0402R]
R121  33  [0402R]
R122  33  [0402R]
R123  33  [0402R]
R124  33  [0402R]
R125  33  [0402R]
R126  33  [0402R]
R127  33  [0402R]
R128  33  [0402R]
R129  33  [0402R]
R130  33  [0402R]
R131  33  [0402R]
R132  33  [0402R]
R133  33  [0402R]
R134  33  [0402R]
R135  33  [0402R]
R136  33  [0402R]
R137  33  [0402R]
U5  M150  [Model Name]  (part B of 4)
U7  STLD40DPUR  [SON8_0R65_3X3]

### Ports
BLE_CTS_UART1 (bidir), BLE_RTS_UART1 (bidir), BLE_RXD_UART1 (bidir), BLE_TXD_UART1 (bidir), DEBUG_LED1 (bidir), DEBUG_LED2 (bidir), DEBUG_LED3 (bidir), O_RESET (bidir), P_PWRControl (bidir), P_RX_UART0 (bidir), P_TX_UART0 (bidir), SDIO_CLK_WIFI (bidir), SDIO_CMD_WIFI (bidir), SDIO_D0_WIFI (bidir), SDIO_D1_WIFI (bidir), SDIO_D2_WIFI (bidir), SDIO_D3_WIFI (bidir), SW_EN_WIFI (bidir), T_ALERT (bidir), T_RESET (bidir)

### Nets
+3.3V: R37.1 R84.2 R85.2 R106.1
BLGND: C41.2 C42.1 C43.1 C44.2 C47.1 C48.2 C49.2 L7.2 R40.1 R42.2 U7.3(GND) U7.9(PGND)
BLVDD: C48.1 C49.1 L4.1 L6.2 R44.2 R86.1
GND: C38.1 C39.1 C40.1 C45.1 C46.1 J3.6(GND) J10.1(GND) J10.7(GND) J10.16(GND) J10.18(GND) J10.21(GND) J10.30(GND) J10.39(GND) L7.1
LCD_VCC: C38.2 C39.2 J10.2(VCC) J10.3(VCC) R38.1 R84.1
LEDBL_3V3: L6.1 R86.2 R105.1
P_PWRControl: R37.2 U5.N19(MSC0_CMD/MSC1_CMD/MSC2_CMD/PE29) ; port P_PWRControl
PER_3V3: R105.2
TP_VCC: C45.2 C46.2 J3.1(VDD) R39.1 R85.1 R107.2 R108.2
BLE_CTS_UART1: U5.P7(UART1_CTS_N/GMAC_RXD3/PD27) ; port BLE_CTS_UART1
BLE_RTS_UART1: U5.N7(UART1_RTS_N/GMAC_TXD3/PD29) ; port BLE_RTS_UART1
BLE_RXD_UART1: U5.N2(UART1_RXD/GMAC_RXD2/PD26) ; port BLE_RXD_UART1
BLE_TXD_UART1: U5.L6(UART1_TXD/GMAC_TXD2/PD28) ; port BLE_TXD_UART1
DEBUG_LED1: U5.N20(MSC0_D0/MSC1_D0/MSC2_D0/PE20) ; port DEBUG_LED1
DEBUG_LED2: U5.P21(MSC0_D1/MSC1_D1/MSC2_D1/PE21) ; port DEBUG_LED2
DEBUG_LED3: U5.R21(MSC0_D2/MSC1_D2/MSC2_D2/PE22) ; port DEBUG_LED3
LCD_B0: J10.15(B0) R110.2
LCD_B0_C: R110.1 U5.H20(LCD_B0/LCD_REV/PC00)
LCD_B1: J10.14(B1) R111.2
LCD_B1_C: R111.1 U5.D19(LCD_B1/LCD_PS/PC01)
LCD_B2: J10.13(B2) R112.2
LCD_B2_C: R112.1 U5.B19(LCD_B2/PC02)
LCD_B3: J10.12(B3) R113.2
LCD_B3_C: R113.1 U5.G20(LCD_B3/PC03)
LCD_B4: J10.11(B4) R114.2
LCD_B4_C: R114.1 U5.F21(LCD_B4/PC04)
LCD_B5: J10.10(B5) R115.2
LCD_B5_C: R115.1 U5.E21(LCD_B5/PC05)
LCD_B6: J10.9(B6) R116.2
LCD_B6_C: R116.1 U5.F20(LCD_B6/PC06)
LCD_B7: J10.8(B7) R117.2
LCD_B7_C: R117.1 U5.C21(LCD_B7/PC07)
LCD_BL_CTRL: R43.2 U5.J19(PWM1/PE01)
LCD_DE: J10.4(DE) R137.2
LCD_DE_C: R137.1 U5.A16(LCD_DE/PC09)
LCD_G0: J10.29(G0) R118.2
LCD_G0_C: R118.1 U5.E20(LCD_G0/LCD_SPL/UART2_TXD/PC10)
LCD_G1: J10.28(G1) R119.2
LCD_G1_C: R119.1 U5.B21(LCD_G1/PC11)
LCD_G2: J10.27(G2) R120.2
LCD_G2_C: R120.1 U5.A21(LCD_G2/PC12)
LCD_G3: J10.26(G3) R121.2
LCD_G3_C: R121.1 U5.D20(LCD_G3/PC13)
LCD_G4: J10.25(G4) R122.2
LCD_G4_C: R122.1 U5.C20(LCD_G4/PC14)
LCD_G5: J10.24(G5) R123.2
LCD_G5_C: R123.1 U5.B20(LCD_G5/PC15)
LCD_G6: J10.23(G6) R124.2
LCD_G6_C: R124.1 U5.E19(LCD_G6/PC16)
LCD_G7: J10.22(G7) R125.2
LCD_G7_C: R125.1 U5.H19(LCD_G7/PC17)
LCD_HS: J10.6(HS) R135.2
LCD_HS_C: R135.1 U5.B16(LCD_HSYN/PC18)
LCD_PCLK: J10.17(PCLK) R134.2
LCD_PCLK_C: R134.1 U5.C15(LCD_PCLK/PC08)
LCD_R0: J10.38(R0) R126.2
LCD_R0_C: R126.1 U5.A19(LCD_R0/LCD_CLS/UART2_RXD/PC20)
LCD_R1: J10.37(R1) R127.2
LCD_R1_C: R127.1 U5.H18(LCD_R1/PC21)
LCD_R2: J10.36(R2) R128.2
LCD_R2_C: R128.1 U5.A18(LCD_R2/PC22)
LCD_R3: J10.35(R3) R129.2
LCD_R3_C: R129.1 U5.D16(LCD_R3/PC23)
LCD_R4: J10.34(R4) R130.2
LCD_R4_C: R130.1 U5.B17(LCD_R4/PC24)
LCD_R5: J10.33(R5) R131.2
LCD_R5_C: R131.1 U5.D18(LCD_R5/PC25)
LCD_R6: J10.32(R6) R132.2
LCD_R6_C: R132.1 U5.B18(LCD_R6/PC26)
LCD_R7: J10.31(R7) R133.2
LCD_R7_C: R133.1 U5.E18(LCD_R7/PC27)
LCD_RESET: C40.2 J3.5(RESET) J10.19(RESET) R38.2 U5.W4(MSC1_D1/SSI0_DT/PD21)  [also labelled TP_RESET]
LCD_VS: J10.5(VS) R136.2
LCD_VS_C: R136.1 U5.C16(LCD_VSYN/PC19)
LED+: C41.1 C42.2 D3.2(K) J10.20(LED+) U7.6(Vo)
LED-: J10.40(LED-) R40.2 U7.4(FB)
O_RESET: U5.V5(MSC1_D2/SSI0_GPC/PD22) ; port O_RESET
P_RX_UART0: U5.U19(UART0_RXD/BCLK/PF00) ; port P_RX_UART0
P_TX_UART0: U5.T19(UART0_TXD/SDATO/PF03) ; port P_TX_UART0
SDIO_CLK_WIFI: U5.Y7(MSC2_CLK/PB28) ; port SDIO_CLK_WIFI
SDIO_CMD_WIFI: U5.Y8(MSC2_CMD/PB29) ; port SDIO_CMD_WIFI
SDIO_D0_WIFI: U5.Y5(MSC2_D0/PB20) ; port SDIO_D0_WIFI
SDIO_D1_WIFI: U5.Y6(MSC2_D1/PB21) ; port SDIO_D1_WIFI
SDIO_D2_WIFI: U5.AA6(MSC2_D2/PB30) ; port SDIO_D2_WIFI
SDIO_D3_WIFI: U5.AA7(MSC2_D3/PB31) ; port SDIO_D3_WIFI
SW_EN_WIFI: R106.2 U5.P20(MSC0_CLK/MSC1_CLK/MSC2_CLK/PE28) ; port SW_EN_WIFI
T_ALERT: U5.Y4(MSC1_D3/SSI0_CE1_N/PD23) ; port T_ALERT
T_RESET: U5.AA4(MSC1_CLK/SSI0_CLK/PD24) ; port T_RESET
TP_I2C_SCK: J3.3(SCL) R108.1 U5.R20(PWM3/I2C2_SCK/SYSCLK/PE03)
TP_I2C_SDA: J3.4(SDA) R107.1 U5.T20(PWM0/I2C2_SDA/PE00)
TP_INT: J3.2(INT) R39.2 U5.W5(MSC1_CMD/SSI0_CE0_N/PD25)
VL: C43.2 C44.1 C47.2 L4.2 L5.1 U7.1(Vi)
NetD3_1: D3.1(A) L5.2 U7.8(SW)
NetR42_1: R42.1 U7.2(Rset)
NetR43_1: R43.1 R44.1 U7.7(EN)

Not connected (* = marked no-connect by the designer): J10 41(NC); U5 AA3(MSC1_D0/SSI0_DR/PD20) J18(PWM2/PE02) N18(MSC0_D3/MSC1_D3/MSC2_D3/PE23) T18(UART0_RTS_N/SDATI/PF02) U20(UART0_CTS_N/LRCLK/PF01); U7 5(NC)*

### Notes on the sheet
- Backlight driver & PFC connector for LCD panel
- (near J3) TP
- (near J3) FPC05006-09200(ATOM)
- ZIF connector placed BOTTOM SIDE
- Touch panel connector for LCD panel
- I2C Address:0x54

### Library data of the parts
C38-C40 C45 = CAP: 厂家：Murata，型号：GRM1555C1H120JA01D
C41 C42 C47 = CAP: 厂家：Murata，型号：; Value: 100pF; Ordered by: Subcon; Published: 8-Jun-2000; Revision: July-2002: Re-released for DXP Platform.; Publisher: Altium Limited
C43 C46 = CAP: Capacitor; Value: 100pF; Ordered by: Subcon; Published: 8-Jun-2000; Revision: July-2002: Re-released for DXP Platform.; Publisher: Altium Limited
C44 = Cap Pol1: Value: 100pF; Ordered by: Subcon; Published: 8-Jun-2000; Revision: July-2002: Re-released for DXP Platform.; Publisher: Altium Limited
C48 = Cap: Capacitor; Value: 10nF; Ordered by: Subcon; Published: 8-Jun-2000; Revision: July-2002: Re-released for DXP Platform.; Publisher: Altium Limited
C49 = Cap Pol1: Polarized Capacitor (Radial); Value: 10uF; Ordered by: Subcon; Published: 8-Jun-2000; Revision: July-2002: Re-released for DXP Platform.; Publisher: Altium Limited
D3 = D Schottky: Schottky Diode; Code - JEDEC: DO-214-AA; Ordered by: ST; Ref St: 9151085; ECCN_US/EU: EAR99/NEC; Published: 8-Jun-2000; Revision: July-2002: Re-released for DXP Platform.; Publisher: Altium Limited; Manuf_1: ST; Manuf_Part_1: STPS1L40M
J3 = FH19C-6S-05SH: ZIF connector placed bottom side; Manuf_1: ATOM; Manuf_2: Hirose; Manuf_Part_1: FPC05006-09200; Ordered by: Subcon; Silkscreen: TS; Manuf_Part_2: FH19C-6S-05SH
L4 L6 L7 = CHOKE: 厂家：MURATA，型号：BLM18AG601SN1
L5 = Inductor: Value: 100uH; Ordered by: Subcon; Published: 8-Jun-2000; Revision: July-2002: Re-released for DXP Platform.; Publisher: Altium Limited
R37 R38 R40 R42 R106 R110-R137 = Res1: Resistor; Value: 1K; Ordered by: Subcon; Published: 8-Jun-2000; Revision: July-2002: Re-released for DXP Platform.; Publisher: Altium Limited
R39 R44 R107 R108 = Res1: 厂家：Yageo，型号：; Value: 1K; Ordered by: Subcon; Published: 8-Jun-2000; Revision: July-2002: Re-released for DXP Platform.; Publisher: Altium Limited
R43 = Res1: Resistor; Value: 1K; Ordered by: Subcon; Fitted: NO; Published: 8-Jun-2000; Revision: July-2002: Re-released for DXP Platform.; Publisher: Altium Limited
R84-R86 R105 = RES1: 厂家：Yageo，型号：RC0402FR-070RL
U7 = STLD40DPMR: Ordered by: ST; Ref St: 9176009; ECCN_US/EU: EAR99/NEC; Manuf_1: ST; Manuf_Part_1: STLD40DPUR

## Sheet M150.SchDoc
size A2
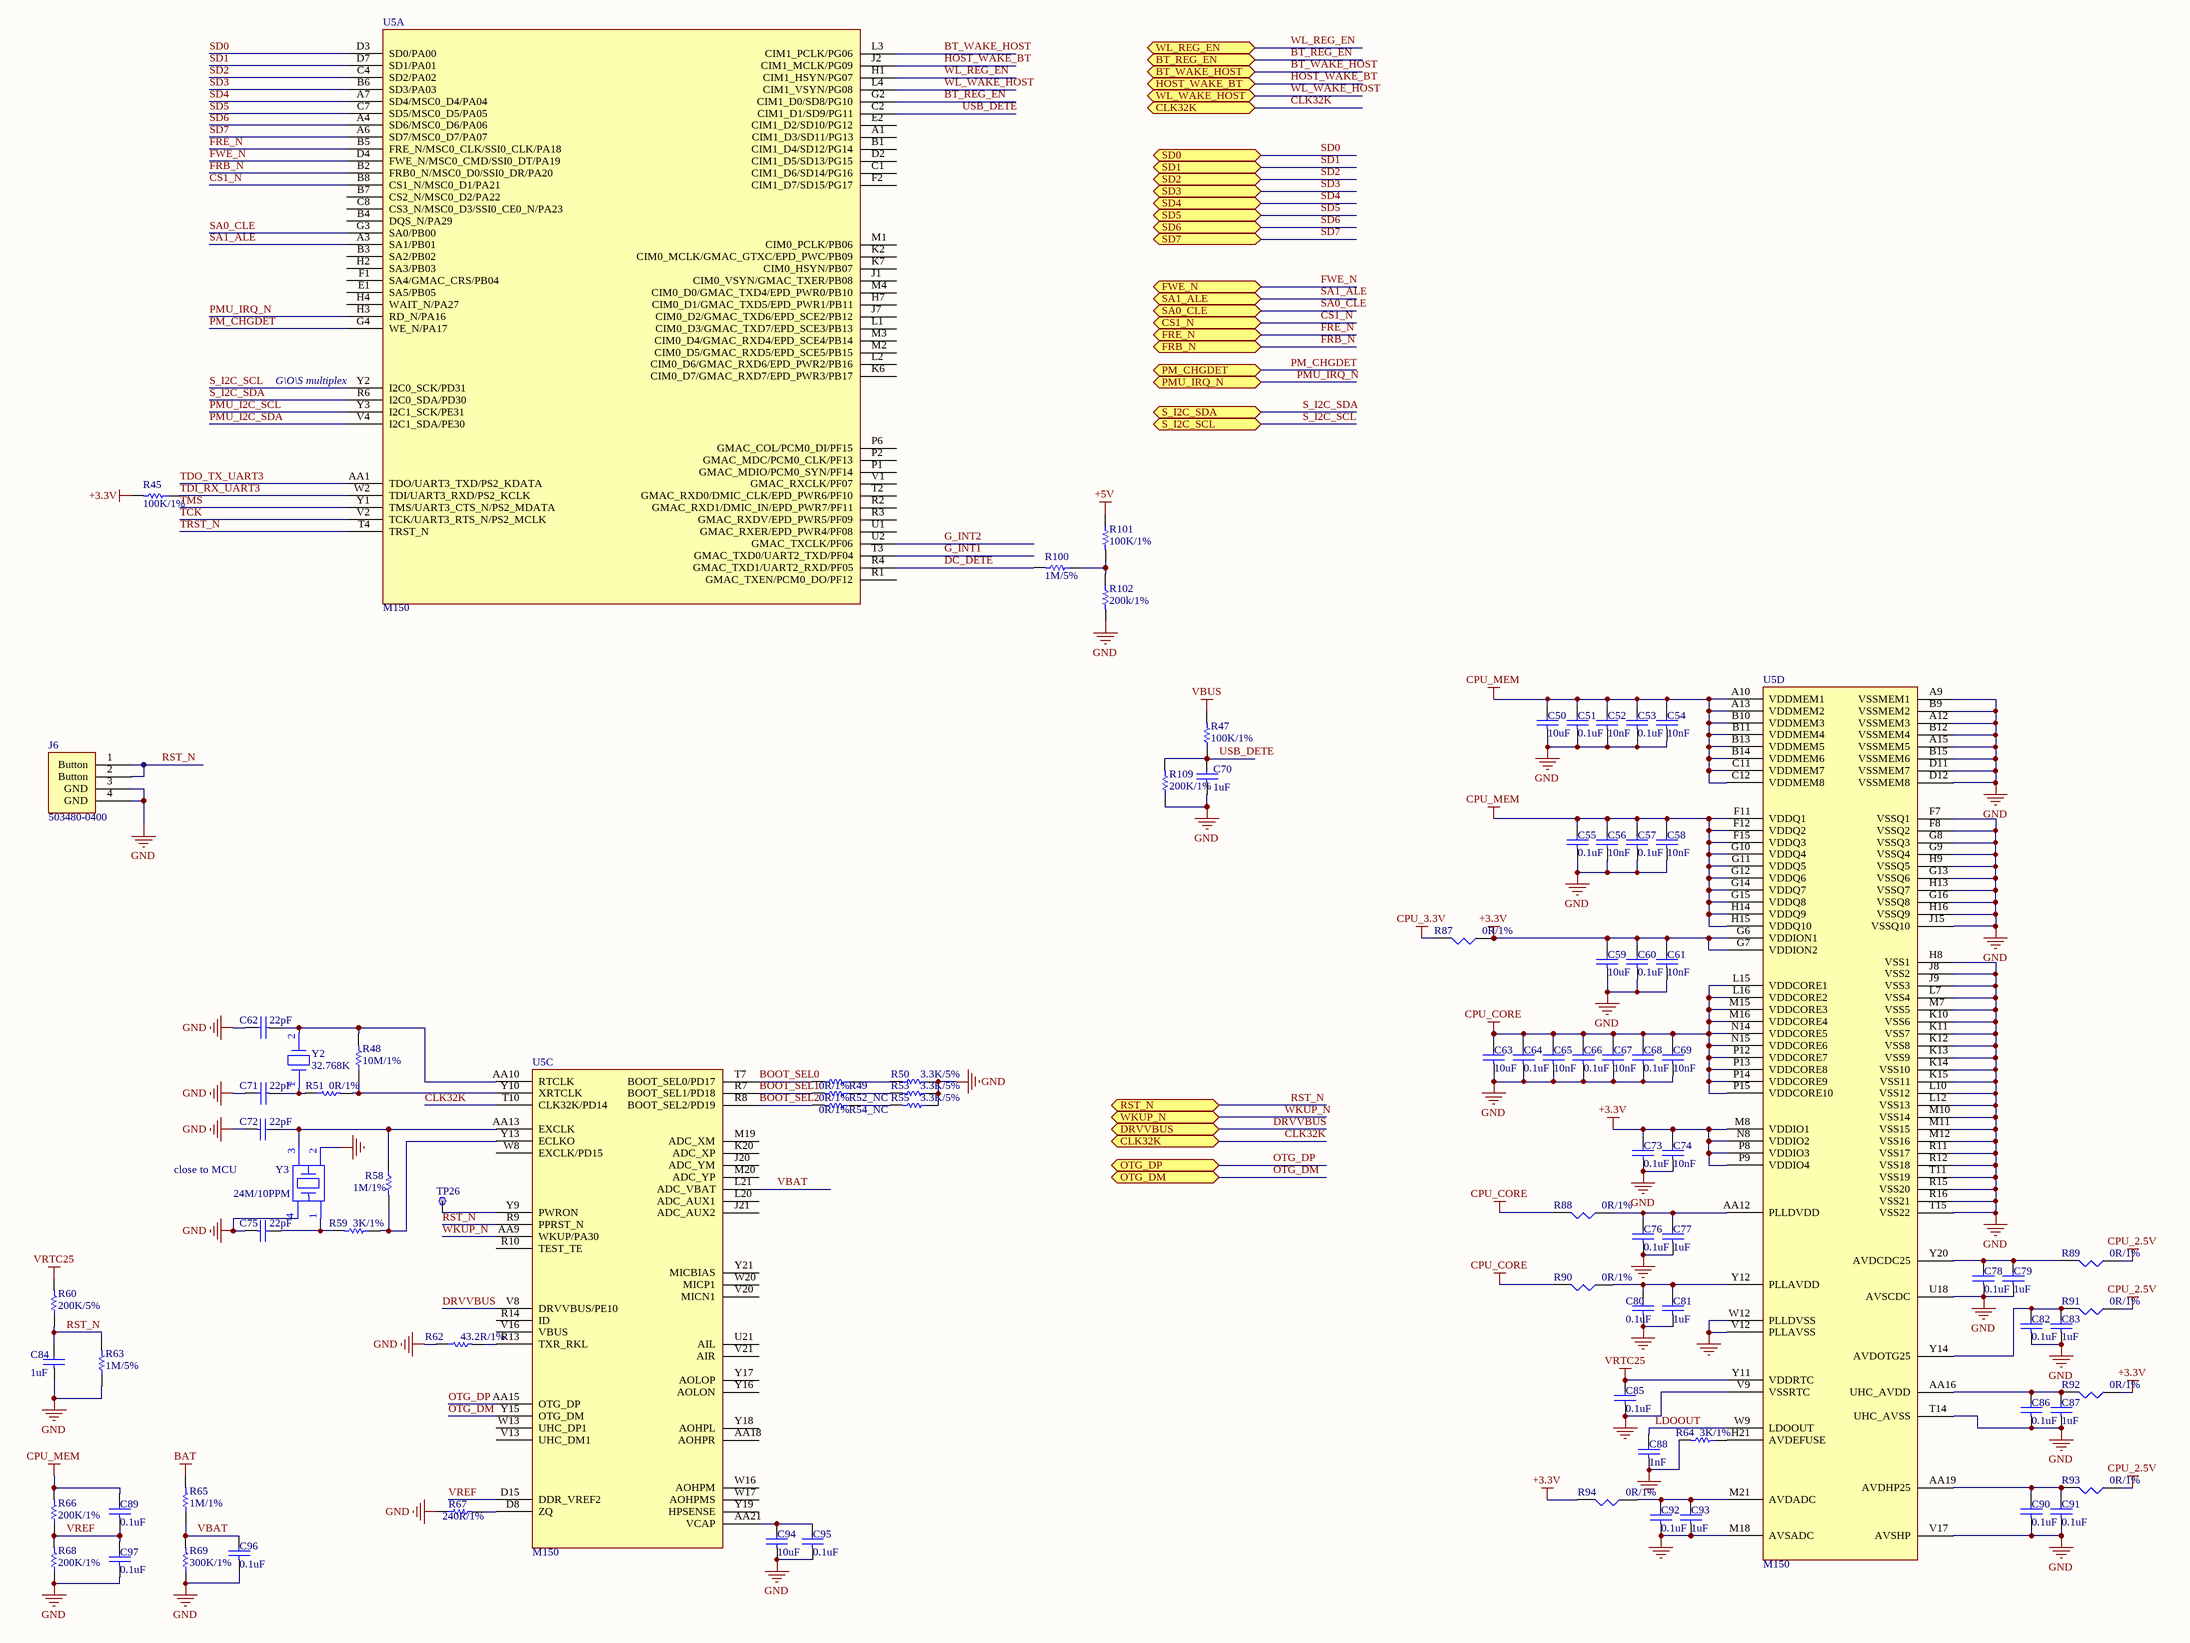
[diagram p7: M150.SchDoc]

### Parts
(Parts that share a designator on the sheet are numbered #1, #2 ... from top to bottom, then left to right.)
C50  10uF  [0402C]
C51  0.1uF  [0402C]
C52  10nF  [0402C]
C53  0.1uF  [0402C]
C54  10nF  [0402C]
C55  0.1uF  [0402C]
C56  10nF  [0402C]
C57  0.1uF  [0402C]
C58  10nF  [0402C]
C59  10uF  [0402C]
C60  0.1uF  [0402C]
C61  10nF  [0402C]
C62  22pF  [0402C]
C63  10uF  [0402C]
C64  0.1uF  [0402C]
C65  10nF  [0402C]
C66  0.1uF  [0402C]
C67  10nF  [0402C]
C68  0.1uF  [0402C]
C69  10nF  [0402C]
C70  1uF  [0402C]
C71  22pF  [0402C]
C72  22pF  [0402C]
C73  0.1uF  [0402C]
C74  10nF  [0402C]
C75  22pF  [0402C]
C76  0.1uF  [0402C]
C77  1uF  [0402C]
C78  0.1uF  [0402C]
C79  1uF  [0402C]
C80  0.1uF  [0402C]
C81  1uF  [0402C]
C82  0.1uF  [0402C]
C83  1uF  [0402C]
C84  1uF  [0402C]
C85  0.1uF  [0402C]
C86  0.1uF  [0402C]
C87  1uF  [0402C]
C88  1nF  [0402C]
C89  0.1uF  [0402C]
C90  0.1uF  [0402C]
C91  0.1uF  [0402C]
C92  0.1uF  [0402C]
C93  1uF  [0402C]
C94  10uF  [0402C]
C95  0.1uF  [0402C]
C96  0.1uF  [0402C]
C97  0.1uF  [0402C]
J6#2  503480-0400
R45  100K/1%  [0402R]
R47  100K/1%  [0402R]
R48  10M/1%  [0603R]
R49  0R/1%  [0603R]
R50  3.3K/5%  [0603R]
R51  0R/1%  [0603R]
R52_NC  0R/1%  [0603R]
R53  3.3K/5%  [0603R]
R54_NC  0R/1%  [0603R]
R55  3.3K/5%  [0603R]
R58  1M/1%  [0402R]
R59  3K/1%  [0402R]
R60  200K/5%  [0402R]
R62  43.2R/1%  [0402R]
R63  1M/5%  [0402R]
R64  3K/1%  [0402R]
R65  1M/1%  [0402R]
R66  200K/1%  [0402R]
R67  240R/1%  [0402R]
R68  200K/1%  [0402R]
R69  300K/1%  [0402R]
R87  0R/1%  [0603R]
R88  0R/1%  [0603R]
R89  0R/1%  [0603R]
R90  0R/1%  [0603R]
R91  0R/1%  [0603R]
R92  0R/1%  [0603R]
R93  0R/1%  [0603R]
R94  0R/1%  [0603R]
R100  1M/5%  [0402R]
R101  100K/1%  [0402R]
R102  200k/1%  [0402R]
R109  200K/1%  [0402R]
TP26  TP  [TP_C40]  (value not drawn)
U5  M150  [Model Name]  (parts A,C,D of 4)
Y2  32.768K  [XTALSMD2-3215]
Y3  24M/10PPM  [XTALSMD2-2520]

### Ports
BT_REG_EN (bidir), BT_WAKE_HOST (bidir), CLK32K (bidir), CS1_N (bidir), DRVVBUS (bidir), FRB_N (bidir), FRE_N (bidir), FWE_N (bidir), HOST_WAKE_BT (bidir), OTG_DM (bidir), OTG_DP (bidir), PM_CHGDET (bidir), PMU_IRQ_N (bidir), RST_N (bidir), S_I2C_SCL (bidir), S_I2C_SDA (bidir), SA0_CLE (bidir), SA1_ALE (bidir), SD0 (bidir), SD1 (bidir), SD2 (bidir), SD3 (bidir), SD4 (bidir), SD5 (bidir), SD6 (bidir), SD7 (bidir), WKUP_N (bidir), WL_REG_EN (bidir), WL_WAKE_HOST (bidir)

### Nets
+3.3V: C59.2 C60.2 C61.2 C73.2 C74.2 R45.2 R87.1 R92.1 R94.2 U5.G6(VDDION1) U5.G7(VDDION2) U5.M8(VDDIO1) U5.N8(VDDIO2) U5.P8(VDDIO3) U5.P9(VDDIO4)
+5V: R101.1  [project net Base_USB_Port1]
BAT: R65.2
CPU_2.5V: R89.1 R91.1 R93.1
CPU_3.3V: R87.2
CPU_CORE: C63.2 C64.2 C65.2 C66.2 C67.2 C68.2 C69.2 R88.2 R90.2 U5.L15(VDDCORE1) U5.L16(VDDCORE2) U5.M15(VDDCORE3) U5.M16(VDDCORE4) U5.N14(VDDCORE5) U5.N15(VDDCORE6) U5.P12(VDDCORE7) U5.P13(VDDCORE8) U5.P14(VDDCORE9) U5.P15(VDDCORE10)
CPU_MEM: C50.2 C51.2 C52.2 C53.2 C54.2 C55.2 C56.2 C57.2 C58.2 C89.2 R66.2 U5.A10(VDDMEM1) U5.A13(VDDMEM2) U5.B10(VDDMEM3) U5.B11(VDDMEM4) U5.B13(VDDMEM5) U5.B14(VDDMEM6) U5.C11(VDDMEM7) U5.C12(VDDMEM8) U5.F11(VDDQ1) U5.F12(VDDQ2) U5.F15(VDDQ3) U5.G10(VDDQ4) U5.G11(VDDQ5) U5.G12(VDDQ6) U5.G14(VDDQ7) U5.G15(VDDQ8) U5.H14(VDDQ9) U5.H15(VDDQ10)
GND: C50.1 C51.1 C52.1 C53.1 C54.1 C55.1 C56.1 C57.1 C58.1 C59.1 C60.1 C61.1 C62.2 C63.1 C64.1 C65.1 C66.1 C67.1 C68.1 C69.1 C70.1 C71.2 C72.1 C73.1 C74.1 C75.1 C76.1 C77.1 C78.1 C79.1 C80.1 C81.1 C82.1 C83.1 C84.1 C85.1 C86.1 C87.1 C88.1 C90.1 C91.1 C92.1 C93.1 C94.1 C95.1 C96.1 C97.1 J6#2.3(GND) J6#2.4(GND) R50.1 R53.1 R55.1 R62.1 R63.1 R64.2 R67.1 R68.1 R69.1 R102.2 R109.1 U5.A9(VSSMEM1) U5.A12(VSSMEM3) U5.A15(VSSMEM5) U5.B9(VSSMEM2) U5.B12(VSSMEM4) U5.B15(VSSMEM6) U5.D11(VSSMEM7) U5.D12(VSSMEM8) U5.F7(VSSQ1) U5.F8(VSSQ2) U5.G8(VSSQ3) U5.G9(VSSQ4) U5.G13(VSSQ6) U5.G16(VSSQ8) U5.H8(VSS1) U5.H9(VSSQ5) U5.H13(VSSQ7) U5.H16(VSSQ9) U5.J8(VSS2) U5.J9(VSS3) U5.J15(VSSQ10) U5.K10(VSS6) U5.K11(VSS7) U5.K12(VSS8) U5.K13(VSS9) U5.K14(VSS10) U5.K15(VSS11) U5.L7(VSS4) U5.L10(VSS12) U5.L12(VSS13) U5.M7(VSS5) U5.M10(VSS14) U5.M11(VSS15) U5.M12(VSS16) U5.M18(AVSADC) U5.R11(VSS17) U5.R12(VSS18) U5.R15(VSS20) U5.R16(VSS21) U5.T11(VSS19) U5.T14(UHC_AVSS) U5.T15(VSS22) U5.U18(AVSCDC) U5.V9(VSSRTC) U5.V12(PLLAVSS) U5.V17(AVSHP) U5.W12(PLLDVSS) Y3.2 Y3.4
VBUS: R47.2  [project net Product_USB_Port2]
VRTC25: C85.2 R60.2 U5.Y11(VDDRTC)
BOOT_SEL0: R49.2 U5.T7(BOOT_SEL0/PD17)
BOOT_SEL1: R52_NC.2 U5.R7(BOOT_SEL1/PD18)
BOOT_SEL2: R54_NC.2 U5.R8(BOOT_SEL2/PD19)
BT_REG_EN: U5.G2(CIM1_D0/SD8/PG10) ; port BT_REG_EN
BT_WAKE_HOST: U5.L3(CIM1_PCLK/PG06) ; port BT_WAKE_HOST
CLK32K: U5.T10(CLK32K/PD14) ; port CLK32K
CS1_N: U5.B8(CS1_N/MSC0_D1/PA21) ; port CS1_N
DC_DETE: R100.2 U5.R4(GMAC_TXD1/UART2_RXD/PF05)
DRVVBUS: U5.V8(DRVVBUS/PE10) ; port DRVVBUS
FRB_N: U5.B2(FRB0_N/MSC0_D0/SSI0_DR/PA20) ; port FRB_N
FRE_N: U5.B5(FRE_N/MSC0_CLK/SSI0_CLK/PA18) ; port FRE_N
FWE_N: U5.D4(FWE_N/MSC0_CMD/SSI0_DT/PA19) ; port FWE_N
G_INT1: U5.T3(GMAC_TXD0/UART2_TXD/PF04)
G_INT2: U5.U2(GMAC_TXCLK/PF06)
HOST_WAKE_BT: U5.J2(CIM1_MCLK/PG09) ; port HOST_WAKE_BT
LDOOUT: C88.2 U5.W9(LDOOUT)
OTG_DM: U5.Y15(OTG_DM) ; port OTG_DM
OTG_DP: U5.AA15(OTG_DP) ; port OTG_DP
PM_CHGDET: U5.G4(WE_N/PA17) ; port PM_CHGDET
PMU_I2C_SCL: U5.Y3(I2C1_SCK/PE31)
PMU_I2C_SDA: U5.V4(I2C1_SDA/PE30)
PMU_IRQ_N: U5.H3(RD_N/PA16) ; port PMU_IRQ_N
RST_N: C84.2 J6#2.1(Button) J6#2.2(Button) R60.1 R63.2 U5.R9(PPRST_N) ; port RST_N
S_I2C_SCL: U5.Y2(I2C0_SCK/PD31) ; port S_I2C_SCL
S_I2C_SDA: U5.R6(I2C0_SDA/PD30) ; port S_I2C_SDA
SA0_CLE: U5.G3(SA0/PB00) ; port SA0_CLE
SA1_ALE: U5.A3(SA1/PB01) ; port SA1_ALE
SD0: U5.D3(SD0/PA00) ; port SD0
SD1: U5.D7(SD1/PA01) ; port SD1
SD2: U5.C4(SD2/PA02) ; port SD2
SD3: U5.B6(SD3/PA03) ; port SD3
SD4: U5.A7(SD4/MSC0_D4/PA04) ; port SD4
SD5: U5.C7(SD5/MSC0_D5/PA05) ; port SD5
SD6: U5.A4(SD6/MSC0_D6/PA06) ; port SD6
SD7: U5.A6(SD7/MSC0_D7/PA07) ; port SD7
TCK: U5.V2(TCK/UART3_RTS_N/PS2_MCLK)
TDI_RX_UART3: R45.1 U5.W2(TDI/UART3_RXD/PS2_KCLK)
TDO_TX_UART3: U5.AA1(TDO/UART3_TXD/PS2_KDATA)
TMS: U5.Y1(TMS/UART3_CTS_N/PS2_MDATA)
TRST_N: U5.T4(TRST_N)
USB_DETE: C70.2 R47.1 R109.2 U5.C2(CIM1_D1/SD9/PG11)
VBAT: C96.2 R65.1 R69.2 U5.L21(ADC_VBAT)
VREF: C89.1 C97.2 R66.1 R68.2 U5.D15(DDR_VREF2)
WKUP_N: U5.AA9(WKUP/PA30) ; port WKUP_N
WL_REG_EN: U5.H1(CIM1_HSYN/PG07) ; port WL_REG_EN
WL_WAKE_HOST: U5.L4(CIM1_VSYN/PG08) ; port WL_WAKE_HOST
NetC62_1: C62.1 R48.2 U5.AA10(RTCLK) Y2.2
NetC71_1: C71.1 R51.1 Y2.1
NetC72_2: C72.2 R58.1 U5.AA13(EXCLK) Y3.3
NetC75_2: C75.2 R59.2 Y3.1
NetC76_2: C76.2 C77.2 R88.1 U5.AA12(PLLDVDD)
NetC78_2: C78.2 C79.2 R89.2 U5.Y20(AVDCDC25)
NetC80_2: C80.2 C81.2 R90.1 U5.Y12(PLLAVDD)
NetC82_2: C82.2 C83.2 R91.2 U5.Y14(AVDOTG25)
NetC86_2: C86.2 C87.2 R92.2 U5.AA16(UHC_AVDD)
NetC90_2: C90.2 C91.2 R93.2 U5.AA19(AVDHP25)
NetC92_2: C92.2 C93.2 R94.1 U5.M21(AVDADC)
NetC94_2: C94.2 C95.2 U5.AA21(VCAP)
NetR48_1: R48.1 R51.2 U5.Y10(XRTCLK)
NetR49_1: R49.1 R50.2
NetR52_NC_1: R52_NC.1 R53.2
NetR54_NC_1: R54_NC.1 R55.2
NetR58_2: R58.2 R59.1 U5.Y13(ECLKO)
NetR62_2: R62.2 U5.R13(TXR_RKL)
NetR64_1: R64.1 U5.H21(AVDEFUSE)
NetR67_2: R67.2 U5.D8(ZQ)
NetR100_1: R100.1 R101.2 R102.1
NetTP26_1: TP26.1 U5.Y9(PWRON)

Not connected (* = marked no-connect by the designer): U5 A1(CIM1_D3/SD11/PG13) AA18(AOHPR) B1(CIM1_D4/SD12/PG14) B3(SA2/PB02) B4(DQS_N/PA29) B7(CS2_N/MSC0_D2/PA22) C1(CIM1_D6/SD14/PG16) C8(CS3_N/MSC0_D3/SSI0_CE0_N/PA23) D2(CIM1_D5/SD13/PG15) E1(SA5/PB05) E2(CIM1_D2/SD10/PG12) F1(SA4/GMAC_CRS/PB04) F2(CIM1_D7/SD15/PG17) H2(SA3/PB03) H4(WAIT_N/PA27) H7(CIM0_D1/GMAC_TXD5/EPD_PWR1/PB11) J1(CIM0_VSYN/GMAC_TXER/PB08) J7(CIM0_D2/GMAC_TXD6/EPD_SCE2/PB12) J20(ADC_YM) J21(ADC_AUX2) K2(CIM0_MCLK/GMAC_GTXC/EPD_PWC/PB09) K6(CIM0_D7/GMAC_RXD7/EPD_PWR3/PB17) K7(CIM0_HSYN/PB07) K20(ADC_XP) L1(CIM0_D3/GMAC_TXD7/EPD_SCE3/PB13) L2(CIM0_D6/GMAC_RXD6/EPD_PWR2/PB16) L20(ADC_AUX1) M1(CIM0_PCLK/PB06) M2(CIM0_D5/GMAC_RXD5/EPD_SCE5/PB15) M3(CIM0_D4/GMAC_RXD4/EPD_SCE4/PB14) M4(CIM0_D0/GMAC_TXD4/EPD_PWR0/PB10) M19(ADC_XM) M20(ADC_YP) P1(GMAC_MDIO/PCM0_SYN/PF14) P2(GMAC_MDC/PCM0_CLK/PF13) P6(GMAC_COL/PCM0_DI/PF15) R1(GMAC_TXEN/PCM0_DO/PF12) R2(GMAC_RXD1/DMIC_IN/EPD_PWR7/PF11) R3(GMAC_RXDV/EPD_PWR5/PF09) R10(TEST_TE) R14(ID) T2(GMAC_RXD0/DMIC_CLK/EPD_PWR6/PF10) U1(GMAC_RXER/EPD_PWR4/PF08) U21(AIL) V1(GMAC_RXCLK/PF07) V13(UHC_DM1) V16(VBUS) V20(MICN1) V21(AIR) W8(EXCLK/PD15) W13(UHC_DP1) W16(AOHPM) W17(AOHPMS) W20(MICP1) Y16(AOLON) Y17(AOLOP) Y18(AOHPL) Y19(HPSENSE) Y21(MICBIAS)

### Notes on the sheet
- (near U5) G\O\S multiplex
- close to MCU

### Library data of the parts
C50-C61 C63-C70 C72-C97 = CAP: 厂家：Murata，型号：GRM1555C1H120JA01D
C62 C71 = CAP: Capacitor; Ordered by: Subcon
J6#2 = 50348: 厂家：Molex，型号：503480-0400
R45 R47-R51 R52_NC R53 R54_NC R55 R58-R60 R62-R69 R100-R102 R109 = Res1: Resistor; Value: 1K; Ordered by: Subcon; Published: 8-Jun-2000; Revision: July-2002: Re-released for DXP Platform.; Publisher: Altium Limited
R87-R94 = RES1: 厂家：Yageo，型号：RC0402FR-070RL
TP26 = TP: Ordered by: Subcon
Y2 = CRYSTAL3: 厂家：EPSON，型号：Q13FC1350000400
Y3 = CR: 厂家：EPSON，型号：Q24FA20H0004400

## Nets that join several sheets
+3.3V: NandFlash (7 pins), PMU (R28.1), LCD_RGB (R37.1 R84.2 R85.2 R106.1), M150 (15 pins)
Base_USB_Port1: PMU (C15.1 U3.20), Peripherals (6 pins), M150 (R101.1)
BAT: PMU (6 pins), M150 (R65.2)
BAT-V: PMU (9 pins), Power (6 pins)
CPU_2.5V: PMU (C33.1 R33.2), M150 (R89.1 R91.1 R93.1)
CPU_3.3V: PMU (8 pins), M150 (R87.2)
CPU_CORE: PMU (C27.2 C28.2 L3.2 U3.8), M150 (19 pins)
CPU_MEM: PMU (C23.2 C24.2 L2.2 U3.31), M150 (29 pins)
GND: Wireless (29 pins), NandFlash (6 pins), PMU (32 pins), Power (12 pins), Peripherals (22 pins), Auxiliary (6 pins), LCD_RGB (14 pins), M150 (109 pins)
P_PWRControl: Power (6 pins), Peripherals (R96.1), LCD_RGB (R37.2 U5.N19)
PER_3V3: PMU (R30.2 TP23.1), Peripherals (R77.2 R95.2), Auxiliary (R36.2), LCD_RGB (R105.2)
Product_USB_Port2: PMU (C21.2 U3.19), Peripherals (D7.2 L8.2 TP42.1), M150 (R47.2)
VRTC25: PMU (C32.1 R19.2 R32.2), M150 (C85.2 R60.2 U5.Y11)
WIFI_VDD: Wireless (5 pins), Power (C108.2 C109.2 L9.2 U8.5)
BLE_CTS_UART1: Wireless (R13.1 TP9.1 U1.41), LCD_RGB (U5.P7)
BLE_RTS_UART1: Wireless (R11.2 TP6.1 U1.44), LCD_RGB (U5.N7)
BLE_RXD_UART1: Wireless (TP8.1 U1.42), LCD_RGB (U5.N2)
BLE_TXD_UART1: Wireless (TP7.1 U1.43), LCD_RGB (U5.L6)
BT_REG_EN: Wireless (R22.1 U1.34), M150 (U5.G2)
BT_WAKE_HOST: Wireless (R10.1 U1.7), M150 (U5.L3)
CLK32K: Wireless (R15.1), M150 (U5.T10)
CS1_N: NandFlash (TP16.1 U2.9), M150 (U5.B8)
DEBUG_LED1: Peripherals (LD1.1), LCD_RGB (U5.N20)
DEBUG_LED2: Peripherals (LD2.1), LCD_RGB (U5.P21)
DEBUG_LED3: Peripherals (LD3.1), LCD_RGB (U5.R21)
DRVVBUS: PMU (R27.2 U3.4), M150 (U5.V8)
FRB_N: NandFlash (R46.2 U2.7), M150 (U5.B2)
FRE_N: NandFlash (U2.8), M150 (U5.B5)
FWE_N: NandFlash (TP15.1 U2.18), M150 (U5.D4)
HOST_WAKE_BT: Wireless (U1.6), M150 (U5.J2)
O_RESET: Peripherals (J7.2 R76.1 TP38.1), LCD_RGB (U5.V5)
OTG_DM: Peripherals (J8.5 TP40.1), M150 (U5.Y15)
OTG_DP: Peripherals (J8.6 TP41.1), M150 (U5.AA15)
P_RX_UART0: Peripherals (J5.3 TP34.1), LCD_RGB (U5.U19)
P_TX_UART0: Peripherals (J5.4 TP35.1), LCD_RGB (U5.T19)
PM_CHGDET: PMU (R23.1 R24.2), M150 (U5.G4)
PMU_IRQ_N: PMU (R28.2 U3.32), M150 (U5.H3)
POWER_KEY: PMU (D2.1 R26.1 TP17.1), Peripherals (J6#1.1 J6#1.2)
RST_N: PMU (R34.1 TP19.1), M150 (6 pins)
S_I2C_SCL: Auxiliary (U4.1), M150 (U5.Y2)
S_I2C_SDA: Peripherals (5 pins), Auxiliary (U4.4), M150 (U5.R6)
SA0_CLE: NandFlash (U2.16), M150 (U5.G3)
SA1_ALE: NandFlash (U2.17), M150 (U5.A3)
SD0: NandFlash (U2.29), M150 (U5.D3)
SD1: NandFlash (U2.30), M150 (U5.D7)
SD2: NandFlash (U2.31), M150 (U5.C4)
SD3: NandFlash (U2.32), M150 (U5.B6)
SD4: NandFlash (U2.41), M150 (U5.A7)
SD5: NandFlash (U2.42), M150 (U5.C7)
SD6: NandFlash (U2.43), M150 (U5.A4)
SD7: NandFlash (U2.44), M150 (U5.A6)
SDIO_CLK_WIFI: Wireless (R12.1 TP13.1), LCD_RGB (U5.Y7)
SDIO_CMD_WIFI: Wireless (C105_NC.2 R7.1 TP5.1 U1.16), LCD_RGB (U5.Y8)
SDIO_D0_WIFI: Wireless (C104_NC.2 R6.1 TP4.1 U1.18), LCD_RGB (U5.Y5)
SDIO_D1_WIFI: Wireless (C103_NC.2 R5.1 TP3.1 U1.19), LCD_RGB (U5.Y6)
SDIO_D2_WIFI: Wireless (C102_NC.2 R4.1 TP2.1 U1.14), LCD_RGB (U5.AA6)
SDIO_D3_WIFI: Wireless (C101_NC.2 R3.1 TP1.1 U1.15), LCD_RGB (U5.AA7)
SW_EN_WIFI: Power (R78.1 U8.3), LCD_RGB (R106.2 U5.P20)
T_ALERT: Peripherals (J4.5 TP31.1), LCD_RGB (U5.Y4)
T_RESET: Peripherals (J4.2 R71.1 TP27.1), LCD_RGB (U5.AA4)
WKUP_N: PMU (C18.2 D2.2 R19.1 TP18.1), M150 (U5.AA9)
WL_REG_EN: Wireless (R21.2 TP11.1 U1.12), M150 (U5.H1)
WL_WAKE_HOST: Wireless (TP10.1 U1.13), M150 (U5.L4)